# EAGLE design AdelinoX3 (EAGLE 9.3.2)
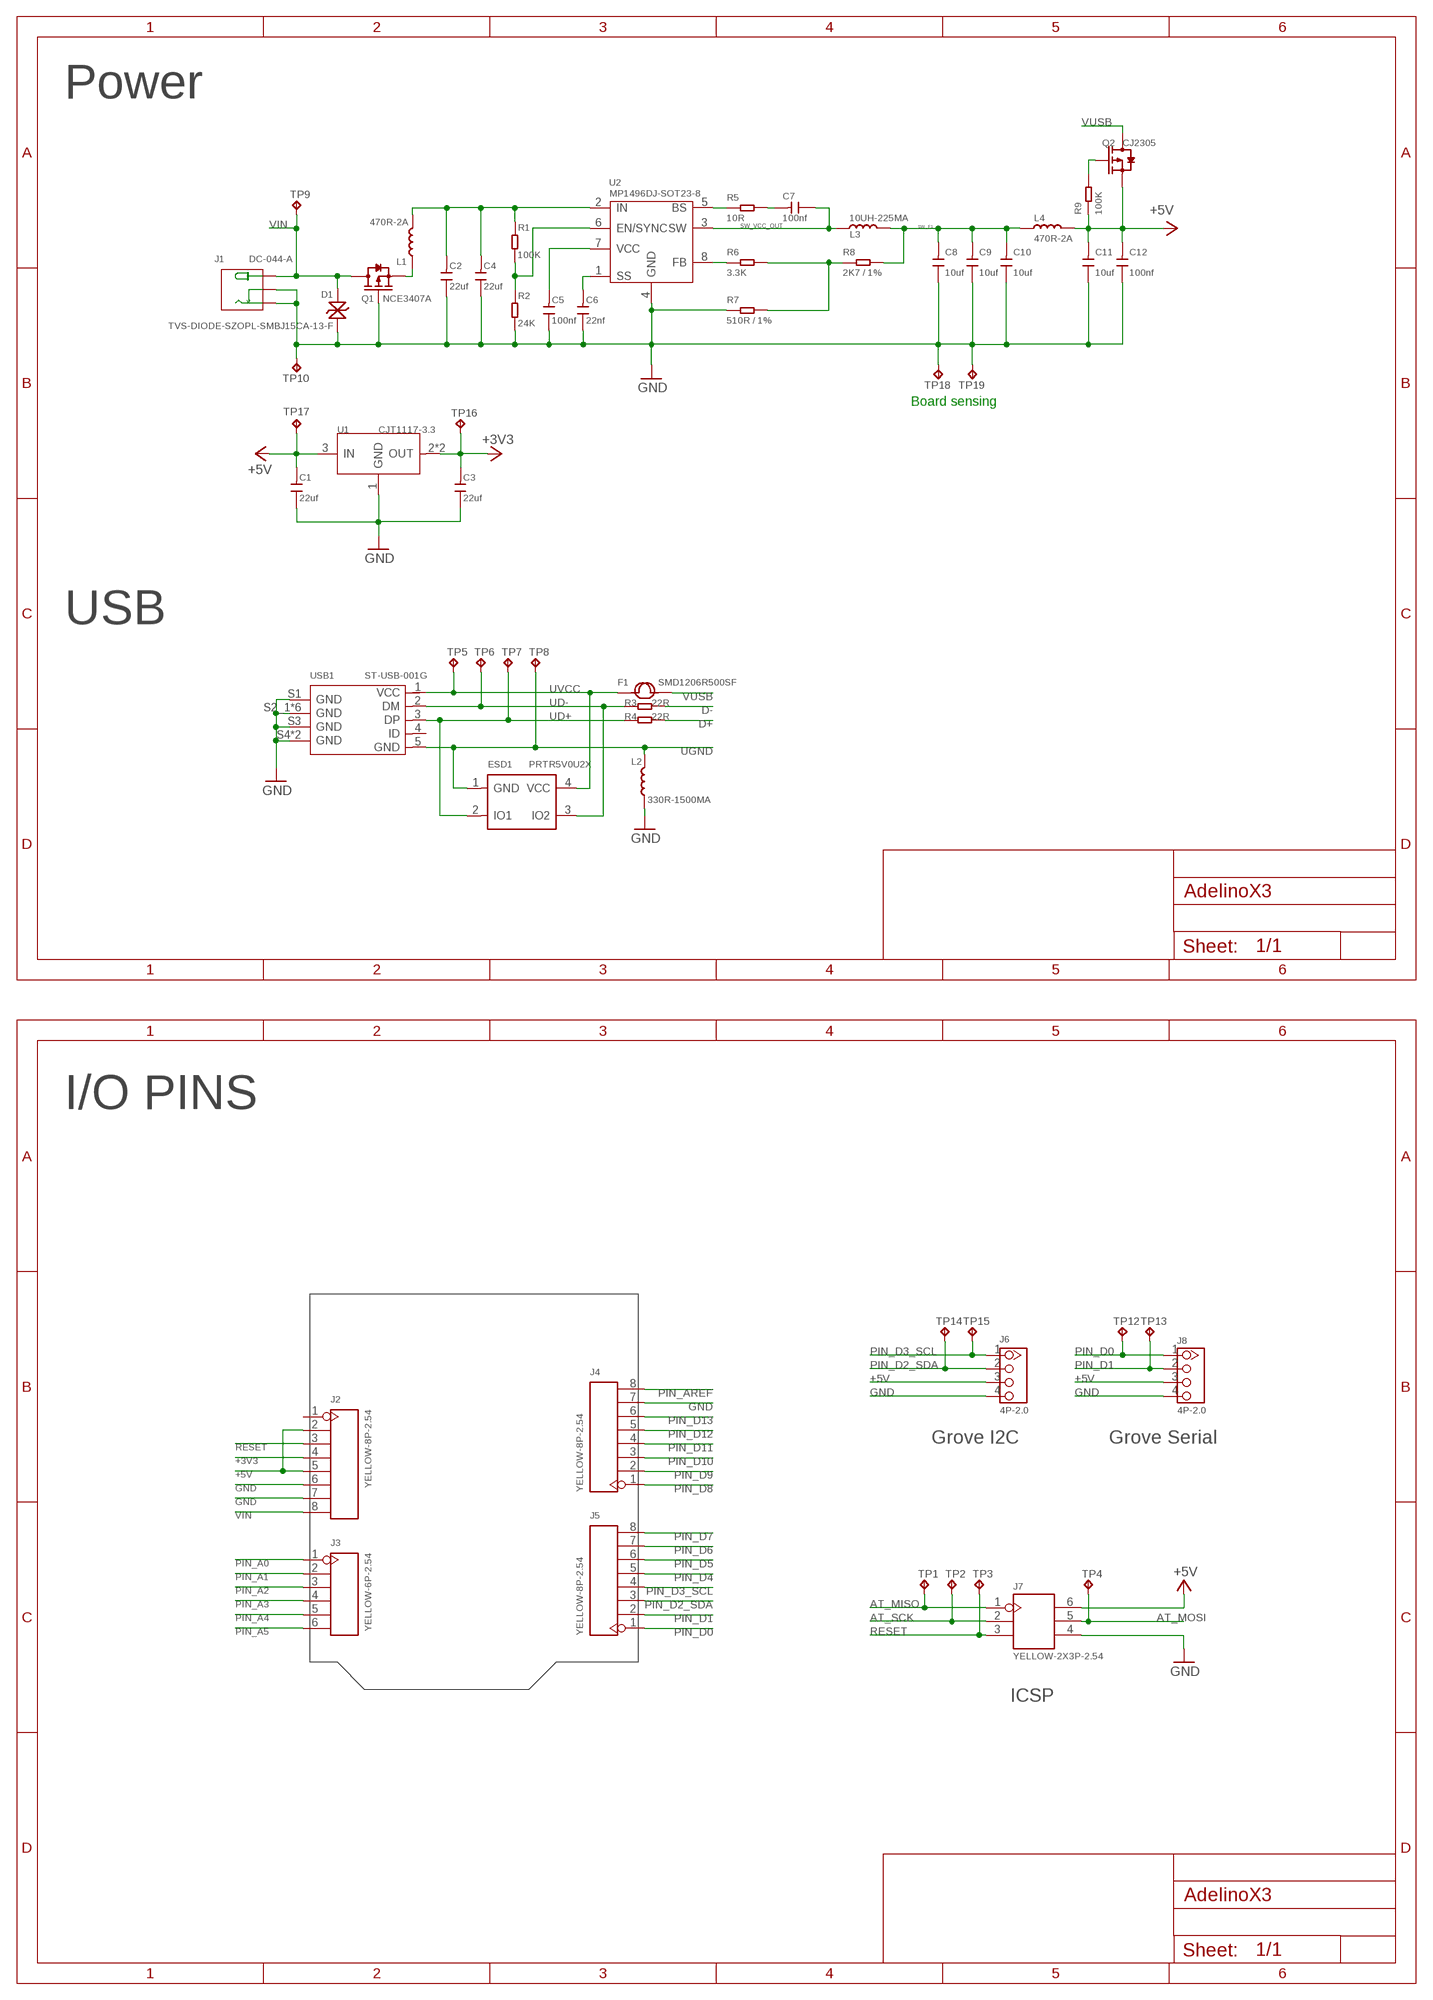
[diagram p0: schematic, sheet 1, part 1 of 2]
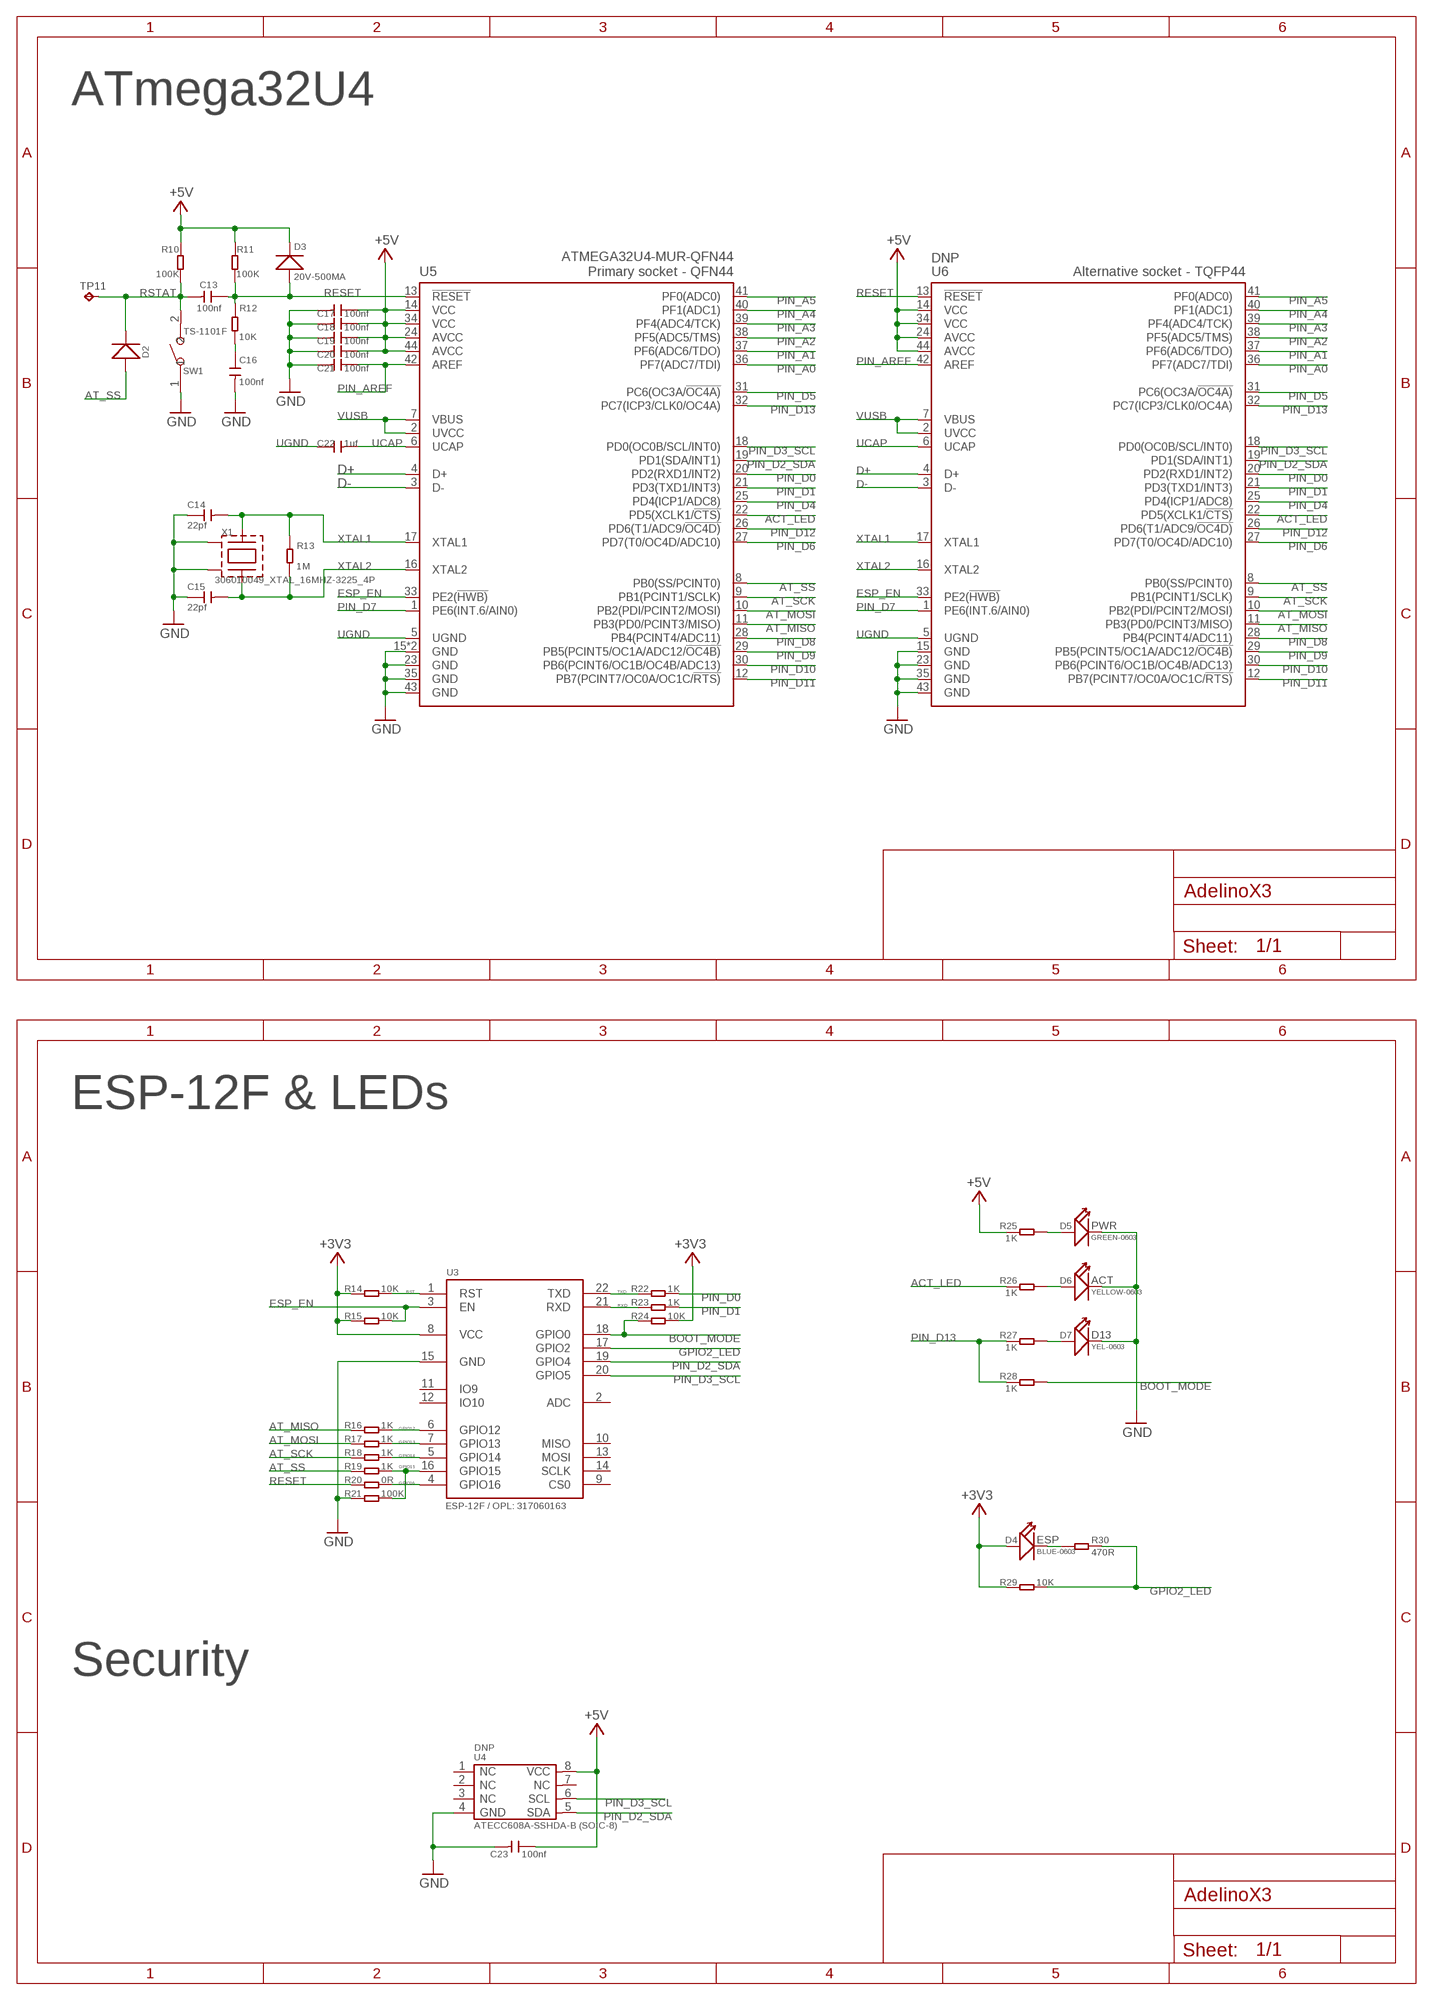
[diagram p1: schematic, sheet 1, part 2 of 2]

## Parts
C1  22uf  CERAMIC-22UF-16V-10%-X7R(1206)  [C1206]
C2  22uf  CERAMIC-22UF-16V-10%-X7R(1206)  [C1206]
C3  22uf  CERAMIC-22UF-16V-10%-X7R(1206)  [C1206]
C4  22uf  CERAMIC-22UF-16V-10%-X7R(1206)  [C1206]
C5  100nf  CERAMIC-100NF-50V-10%-X7R(0603)  [C0603]
C6  22nf  CERAMIC-22NF-50V-10%-X7R(0603)  [C0603]
C7  100nf  CERAMIC-100NF-50V-10%-X7R(0603)  [C0603]
C8  10uf  CERAMIC-10UF-25V-10%-X5R(0805)  [C0805]
C9  10uf  CERAMIC-10UF-25V-10%-X5R(0805)  [C0805]
C10  10uf  CERAMIC-10UF-25V-10%-X5R(0805)  [C0805]
C11  10uf  CERAMIC-10UF-25V-10%-X5R(0805)  [C0805]
C12  100nf  CERAMIC-100NF-50V-10%-X7R(0603)  [C0603]
C13  100nf  CERAMIC-100NF-50V-10%-X7R(0603)  [C0603]
C14  22pf  CERAMIC-22PF-50V-5%-NPO(0603)  [C0603]
C15  22pf  CERAMIC-22PF-50V-5%-NPO(0603)  [C0603]
C16  100nf  CERAMIC-100NF-50V-10%-X7R(0603)  [C0603]
C17  100nf  CERAMIC-100NF-50V-10%-X7R(0603)  [C0603]
C18  100nf  CERAMIC-100NF-50V-10%-X7R(0603)  [C0603]
C19  100nf  CERAMIC-100NF-50V-10%-X7R(0603)  [C0603]
C20  100nf  CERAMIC-100NF-50V-10%-X7R(0603)  [C0603]
C21  100nf  CERAMIC-100NF-50V-10%-X7R(0603)  [C0603]
C22  1uf  CERAMIC-1UF-25V-10%-X7R(0603)  [C0603]
C23  100nf  CERAMIC-100NF-50V-10%-X7R(0603)  [C0603]
D1  TVS-DIODE-SZOPL-SMBJ15CA-13-F  [DO-214AA]
D2  20V-500MA  SMD-DIODE-SCHOTTKY-20V-500MA(SOD-123)P  [SOD-123]
D3  20V-500MA  SMD-DIODE-SCHOTTKY-20V-500MA(SOD-123)P  [SOD-123]
D4  BLUE-0603  SMD-LED-CLEAR-BLUE(0603)  [LED-0603]
D5  GREEN-0603  SMD-LED-CLEAR-GREEN(0603)  [LED-0603]
D6  YELLOW-0603  SMD-LED-CLEAR-YELLOW(0603)  [LED-0603]
D7  YEL-0603  SMD-LED-CLEAR-YELLOW(0603)  [LED-0603]
ESD1  PRTR5V0U2X  SMD-DIODE-TVS-5.5V  [SOT-143B]
F1  SMD1206R500SF  SMD-PPTC-500MA(1206)  [F1206]
J1  DC-044-A  JACK-DC-044-A  [DCJ3P-11.6X9.6X7.0MM]
J2  YELLOW-8P-2.54  DIP-YELLOW-FEMALE-HEADER(8P-2.54)  [H8-2.54]
J3  YELLOW-6P-2.54  DIP-YELLOW-FEMALE-HEADER-VERT(6P-2.54)  [H6-2.54]
J4  YELLOW-8P-2.54  DIP-YELLOW-FEMALE-HEADER(8P-2.54)  [H8-2.54]
J5  YELLOW-8P-2.54  DIP-YELLOW-FEMALE-HEADER(8P-2.54)  [H8-2.54]
J6  4P-2.0  GROVE-CONNECTOR-DIP(4P-2.0)  [HW4-2.0]
J7  YELLOW-2X3P-2.54  DIP-YELLOW-MALE-HEADER-VERT(2X3P-2.54)  [H2X3-2.54]
J8  4P-2.0  GROVE-CONNECTOR-DIP(4P-2.0)  [HW4-2.0]
L1  470R-2A  SMD-FERRITE-BEAD-470R-2A(0805)'0805'  [L0805]
L2  330R-1500MA  SMD-FERRITE-BEAD-330R-1500MA(0805)'0805'  [L0805]
L3  10UH-225MA  SMD-INDUCTOR-10UH-20%-2.35A(2P-5X5X4MM)  [L5040S]
L4  470R-2A  SMD-FERRITE-BEAD-470R-2A(0805)'0805'  [L0805]
Q1  NCE3407A  SMD-MOSFET-P-CH-VDC=30V-ID=4.3A-NCE3407A(SOT-23)  [SOT-23]
Q2  CJ2305  SMD-MOSFET-P-CH-8V-4.1A-CJ2305(SOT-23)  [SOT-23]
R1  100K  SMD-RES-100K-5%-1/10W(0603)  [R0603]
R2  24K  SMD-RES-24K-1%-1/10W(0603)  [R0603]
R3  22R  SMD-RES-22R-5%-1/10W(0603)  [R0603]
R4  22R  SMD-RES-22R-5%-1/10W(0603)  [R0603]
R5  10R  SMD-RES-10R-1%-1/10W(0603)  [R0603]
R6  3.3K  SMD-RES-3.3K-5%-1/10W(0603)  [R0603]
R7  3K / 1%  SMD-RES-510R-1%-1/10W(0603)  [R0603]
R8  2K7 / 1%  SMD-RES-2.7K-1%-1/10W(0603)  [R0603]
R9  100K  SMD-RES-100K-5%-1/10W(0603)  [R0603]
R10  100K  SMD-RES-100K-5%-1/10W(0603)  [R0603]
R11  100K  SMD-RES-100K-5%-1/10W(0603)  [R0603]
R12  10K  SMD-RES-10K-5%-1/10W(0603)  [R0603]
R13  1M  SMD-RES-1M-5%-1/10W(0603)  [R0603]
R14  10K  SMD-RES-10K-5%-1/10W(0603)  [R0603]
R15  10K  SMD-RES-10K-5%-1/10W(0603)  [R0603]
R16  1K  SMD-RES-1K-5%-1/10W(0603)  [R0603]
R17  1K  SMD-RES-1K-5%-1/10W(0603)  [R0603]
R18  1K  SMD-RES-1K-5%-1/10W(0603)  [R0603]
R19  1K  SMD-RES-1K-5%-1/10W(0603)  [R0603]
R20  0R  SMD-RES-0R-5%-1/10W(0603)  [R0603]
R21  100K  SMD-RES-100K-5%-1/10W(0603)  [R0603]
R22  1K  SMD-RES-1K-5%-1/10W(0603)  [R0603]
R23  1K  SMD-RES-1K-5%-1/10W(0603)  [R0603]
R24  10K  SMD-RES-10K-5%-1/10W(0603)  [R0603]
R25  1K  SMD-RES-1K-5%-1/10W(0603)  [R0603]
R26  1K  SMD-RES-1K-5%-1/10W(0603)  [R0603]
R27  1K  SMD-RES-1K-5%-1/10W(0603)  [R0603]
R28  1K  SMD-RES-1K-5%-1/10W(0603)  [R0603]
R29  10K  SMD-RES-10K-5%-1/10W(0603)  [R0603]
R30  470R  SMD-RES-470R-5%-1/10W(0603)  [R0603]
SW1  TS-1101F  DIP-BUTTON(2P-6.0X3.0X4.3MM)-TS-1101F  [SW2-5.0-6.0X3.0X4.3MM]
TP1  TPTP16R  [TP16R]
TP2  TPTP16R  [TP16R]
TP3  TPTP16R  [TP16R]
TP4  TPTP16R  [TP16R]
TP5  TPTP16R  [TP16R]
TP6  TPTP16R  [TP16R]
TP7  TPTP16R  [TP16R]
TP8  TPTP16R  [TP16R]
TP9  TPTP16R  [TP16R]
TP10  TPTP16R  [TP16R]
TP11  TPTP16R  [TP16R]
TP12  TPTP16R  [TP16R]
TP13  TPTP16R  [TP16R]
TP14  TPTP16R  [TP16R]
TP15  TPTP16R  [TP16R]
TP16  TPTP16R  [TP16R]
TP17  TPTP16R  [TP16R]
TP18  TPTP16R  [TP16R]
TP19  TPTP16R  [TP16R]
U1  CJT1117-3.3  PMIC-CJT1117-3.3(SOT223)  [SOT-223]
U2  MP1496DJ-SOT23-8  PMIC-MP1496DJ(SOT23-8)  [SOT-23-8]
U3  ESP-12F / OPL: 317060163  ESP-12F  [ESP-12F]
U4  DNP  ATECC608(SOIC8)  [SOIC8-1.27-5X4MM]
U5  ATMEGA32U4-MUR-QFN44  MCU-ATMEGA32U4-MUR(VQFN44)  [QFN44G-0.5-7X7MM]
U6  DNP  MCU-ATMEGA32U4-AU(TQFP44)  [TQFP44-0.8-9.6X9.6MM]
USB1  ST-USB-001G  MICRO-USB-SMD-B-WITHOUT-POST-W/P(ST-USB-001G)  [MICRO-USB5+4P-SMD-0.65-B]
X1  306010049_XTAL_16MHZ-3225_4P  [X3225_4P]

## Nets
+3V3: C3.2 D4.+ J2.4 R14.1 R15.1 R24.2 R29.1 TP16.TP U1.2(OUT) U1.TER(OUT) U3.8(VCC)
+5V: C1.2 C11.2 C12.2 C17.1 C18.1 C19.1 C20.1 C23.1 D3.- J2.2 J2.5 J6.3 J7.6 J8.3 L4.2 Q2.2(S) R9.1 R10.1 R11.2 R25.1 TP17.TP U1.3(IN) U4.8(VCC) U5.14(VCC) U5.24(AVCC) U5.34(VCC) U5.44(AVCC) U6.14(VCC) U6.24(AVCC) U6.34(VCC) U6.44(AVCC)
_ACT: D6.+ R26.2
_D13: D7.+ R27.2
_ESP: D4.- R30.1
_PWR: D5.+ R25.2
ACT_LED: R26.1 U5.22(PD5(XCLK1/!CTS)) U6.22(PD5(XCLK1/!CTS))
AT_MISO: J7.1 R16.1 TP1.TP U5.11(PB3(PD0/PCINT3/MISO)) U6.11(PB3(PD0/PCINT3/MISO))
AT_MOSI: J7.5 R17.1 TP4.TP U5.10(PB2(PDI/PCINT2/MOSI)) U6.10(PB2(PDI/PCINT2/MOSI))
AT_SCK: J7.2 R18.1 TP2.TP U5.9(PB1(PCINT1/SCLK)) U6.9(PB1(PCINT1/SCLK))
AT_SS: D2.+ R19.1 U5.8(PB0(SS/PCINT0)) U6.8(PB0(SS/PCINT0))
BOOT_MODE: R24.1 R28.2 U3.18(GPIO0)
D+: R4.2 U5.4(D+) U6.4(D+)
D-: R3.2 U5.3(D-) U6.3(D-)
ESP_EN: R15.2 U3.3(EN) U5.33(PE2(!HWB)) U6.33(PE2(!HWB))
GND: C1.1 C2.1 C3.1 C4.1 C5.1 C6.1 C8.1 C9.1 C10.1 C11.1 C12.1 C14.1 C15.1 C16.2 C17.2 C18.2 C19.2 C20.2 C21.2 C23.2 D1.+ D5.- D6.- D7.- J1.CDN1(CDN) J1.CDN2(CDN) J1.CDN3(CDN) J1.CDN4(CDN) J1.GND1(-) J1.GND2(-) J1.GND3(-) J1.GND4(-) J2.6 J2.7 J4.7 J6.4 J7.4 J8.4 L2.1 Q1.1(G) R2.1 R7.1 R21.1 SW1.1 TP10.TP TP18.TP TP19.TP U1.1(GND) U2.4(GND) U3.15(GND) U4.4(GND) U5.15(GND) U5.23(GND) U5.35(GND) U5.43(GND) U5.TAB(GND) U6.15(GND) U6.23(GND) U6.35(GND) U6.43(GND) USB1.S1(GND) USB1.S2_1(GND) USB1.S2_2(GND) USB1.S2_3(GND) USB1.S3(GND) USB1.S4(GND) USB1.S5_1(GND) USB1.S5_2(GND) USB1.S5_3(GND) USB1.S6(GND) X1.P$2(GND1) X1.P$4(GND2)
GPIO2_LED: R29.2 R30.2 U3.17(GPIO2)
GPIO12: R16.2 U3.6(GPIO12)
GPIO13: R17.2 U3.7(GPIO13)
GPIO14: R18.2 U3.5(GPIO14)
GPIO15: R19.2 R21.2 U3.16(GPIO15)
GPIO16: R20.2 U3.4(GPIO16)
N$3: Q2.1(G) R9.2
N$7: R1.2 R2.2 U2.6(EN/SYNC)
N$8: L1.1 Q1.2(S)
N$13: C16.1 R12.2
N$15: C7.2 R5.2
N$23: R6.2 R7.2 R8.1
PIN_A0: J3.1 U5.36(PF7(ADC7/TDI)) U6.36(PF7(ADC7/TDI))
PIN_A1: J3.2 U5.37(PF6(ADC6/TDO)) U6.37(PF6(ADC6/TDO))
PIN_A2: J3.3 U5.38(PF5(ADC5/TMS)) U6.38(PF5(ADC5/TMS))
PIN_A3: J3.4 U5.39(PF4(ADC4/TCK)) U6.39(PF4(ADC4/TCK))
PIN_A4: J3.5 U5.40(PF1(ADC1)) U6.40(PF1(ADC1))
PIN_A5: J3.6 U5.41(PF0(ADC0)) U6.41(PF0(ADC0))
PIN_AREF: C21.1 J4.8 U5.42(AREF) U6.42(AREF)
PIN_D0: J5.1 J8.1 R22.2 TP12.TP U5.20(PD2(RXD1/INT2)) U6.20(PD2(RXD1/INT2))
PIN_D1: J5.2 J8.2 R23.2 TP13.TP U5.21(PD3(TXD1/INT3)) U6.21(PD3(TXD1/INT3))
PIN_D2_SDA: J5.3 J6.2 TP14.TP U3.19(GPIO4) U4.5(SDA) U5.19(PD1(SDA/INT1)) U6.19(PD1(SDA/INT1))
PIN_D3_SCL: J5.4 J6.1 TP15.TP U3.20(GPIO5) U4.6(SCL) U5.18(PD0(OC0B/SCL/INT0)) U6.18(PD0(OC0B/SCL/INT0))
PIN_D4: J5.5 U5.25(PD4(ICP1/ADC8)) U6.25(PD4(ICP1/ADC8))
PIN_D5: J5.6 U5.31(PC6(OC3A/!OC4A)) U6.31(PC6(OC3A/!OC4A))
PIN_D6: J5.7 U5.27(PD7(T0/OC4D/ADC10)) U6.27(PD7(T0/OC4D/ADC10))
PIN_D7: J5.8 U5.1(PE6(INT.6/AIN0)) U6.1(PE6(INT.6/AIN0))
PIN_D8: J4.1 U5.28(PB4(PCINT4/ADC11)) U6.28(PB4(PCINT4/ADC11))
PIN_D9: J4.2 U5.29(PB5(PCINT5/OC1A/ADC12/!OC4B)) U6.29(PB5(PCINT5/OC1A/ADC12/!OC4B))
PIN_D10: J4.3 U5.30(PB6(PCINT6/OC1B/OC4B/ADC13)) U6.30(PB6(PCINT6/OC1B/OC4B/ADC13))
PIN_D11: J4.4 U5.12(PB7(PCINT7/OC0A/OC1C/!RTS)) U6.12(PB7(PCINT7/OC0A/OC1C/!RTS))
PIN_D12: J4.5 U5.26(PD6(T1/ADC9/!OC4D)) U6.26(PD6(T1/ADC9/!OC4D))
PIN_D13: J4.6 R27.1 R28.1 U5.32(PC7(ICP3/CLK0/OC4A)) U6.32(PC7(ICP3/CLK0/OC4A))
RESET: C13.1 D3.+ J2.3 J7.3 R11.1 R12.1 R20.1 TP3.TP U5.13(!RESET) U6.13(!RESET)
RST: R14.2 U3.1(RST)
RSTAT: C13.2 D2.- R10.2 SW1.2 TP11.TP
RXD: R23.1 U3.21(RXD)
SW_BS: R5.1 U2.5(BS)
SW_F1: C8.2 C9.2 C10.2 L3.2 L4.1 R8.2
SW_FB: R6.1 U2.8(FB)
SW_SS: C6.2 U2.1(SS)
SW_VCAP: C5.2 U2.7(VCC)
SW_VCC_IN: C2.2 C4.2 L1.2 R1.1 U2.2(IN)
SW_VCC_OUT: C7.1 L3.1 U2.3(SW)
TXD: R22.1 U3.22(TXD)
UCAP: C22.2 U5.6(UCAP) U6.6(UCAP)
UD+ [usb]: ESD1.2(IO1) R4.1 TP7.TP USB1.3(DP)
UD- [usb]: ESD1.3(IO2) R3.1 TP6.TP USB1.2(DM)
UGND: C22.1 ESD1.1(GND) L2.2 TP8.TP U5.5(UGND) U6.5(UGND) USB1.5(GND)
UVCC: ESD1.4(VCC) F1.1 TP5.TP USB1.1(VCC)
VIN: D1.- J1.VCC1(+) J1.VCC2(+) J1.VCC3(+) J1.VCC4(+) J2.8 Q1.3(D) TP9.TP
VUSB: F1.2 Q2.3(D) U5.2(UVCC) U5.7(VBUS) U6.2(UVCC) U6.7(VBUS)
XTAL1: C14.2 R13.2 U5.17(XTAL1) U6.17(XTAL1) X1.P$1
XTAL2: C15.2 R13.1 U5.16(XTAL2) U6.16(XTAL2) X1.P$3
Unconnected: J2.1 U3.2(ADC) U3.9(CS0) U3.10(MISO) U3.11(IO9) U3.12(IO10) U3.13(MOSI) U3.14(SCLK) U4.1(NC1) U4.2(NC2) U4.3(NC3) U4.7(NC4) USB1.4(ID)

## Notes on the sheet
- Power | ATmega32U4
- Board sensing
- USB
- I/O PINS | ESP-12F & LEDs
- Grove I2C | Grove Serial
- Security
- ICSP

## Library data of the parts
C1 C2 C4 = Seeed-Capacitor:CERAMIC-22UF-16V-10%-X7R(1206): 302010182
C3 = OPL_Capacitor:CERAMIC-22UF-16V-10%-X7R(1206): 302010182
C5 C7 C12 C13 C16-C21 = OPL_Capacitor:CERAMIC-100NF-50V-10%-X7R(0603): 302010138; MPN: CC0603KRX7R9BB104
C6 = Seeed-Capacitor:CERAMIC-22NF-50V-10%-X7R(0603): 302010095; MPN: CC0603KRX7R9BB223
C8-C11 = Seeed-Capacitor:CERAMIC-10UF-25V-10%-X5R(0805): 302010178; MPN: CC0805KKX5R8BB106
C14 C15 = Seeed-Capacitor:CERAMIC-22PF-50V-5%-NPO(0603): 302010143; MPN: CC0603JRNPO9BN220
C22 = Seeed-Capacitor:CERAMIC-1UF-25V-10%-X7R(0603): 302010139; MPN: CC0603KRX7R8BB105
C23 = Seeed-Capacitor:CERAMIC-100NF-50V-10%-X7R(0603): 302010138; MPN: CC0603KRX7R9BB104
D1 = Adelino-Misc:TVS-DIODE-SZOPL-SMBJ15CA-13-F: SMD Diode TVS 24VWM/38.9VC-600W;DO-214AA(SMB); MPN: SMBJ15CA-13-F; SKU: SHENZHEN-OPL;TVS DIODE 15VWM 24.4VC SMB
D2 D3 = Seeed-Diode:SMD-DIODE-SCHOTTKY-20V-500MA(SOD-123)P: 304020028; MPN: MBR0520LT1G
D4 = Seeed-LED:SMD-LED-CLEAR-BLUE(0603): 304090045; LABEL: ESP; MPN: 19-217-BHC-ZL1M2RY-3T
D5 = Seeed-LED:SMD-LED-CLEAR-GREEN(0603): 304090043; LABEL: PWR; MPN: 19-217-G7C-AN1P2-3T
D6 = Seeed-LED:SMD-LED-CLEAR-YELLOW(0603): 304090044; LABEL: ACT; MPN: 19-217-Y5C-AM1N1VY-3T
D7 = Seeed-LED:SMD-LED-CLEAR-YELLOW(0603): 304090044; LABEL: D13; MPN: 19-217-Y5C-AM1N1VY-3T; VALUE: YELLOW-0603
ESD1 = Seeed-OPL-2017-01-Diode-james:SMD-DIODE-TVS-5.5V: SMD Diode TVS;5.5V; MPN: NXP;PRTR5V0U2X,215; SKU: 304050022
F1 = Seeed-Fuse:SMD-PPTC-500MA(1206): 307010002; MPN: SMD1206R500SF
J1 = Seeed-Connector:JACK-DC-044-A: 320120002; MPN: JACK-DC-044-A
J2 J4 J5 = Seeed-Connector:DIP-YELLOW-FEMALE-HEADER(8P-2.54): 320030065; MPN: F185-1108A1BSYC1
J3 = Seeed-Connector:DIP-YELLOW-FEMALE-HEADER-VERT(6P-2.54): 320030019; MPN: F185-1106A1BSYA3
J6 J8 = Seeed-Connector:GROVE-CONNECTOR-DIP(4P-2.0): 320110033
J7 = Seeed-Connector:DIP-YELLOW-MALE-HEADER-VERT(2X3P-2.54): 320020027; MPN: P125-1203A0BS116A2
L1 L4 = OPL_Ferrite_and_Magnetic_Bead:SMD-FERRITE-BEAD-470R-2A(0805): 303030008; MPN: WLB2012-471T20
L2 = Seeed-Inductor:SMD-FERRITE-BEAD-330R-1500MA(0805): 303030006; MPN: BLM21PG331SN1D
L3 = Seeed-Inductor:SMD-INDUCTOR-10UH-20%-2.35A(2P-5X5X4MM): 303010147
Q1 = Seeed-Transistor:SMD-MOSFET-P-CH-VDC=30V-ID=4.3A-NCE3407A(SOT-23): 305030010; MPN: NCE3407A
Q2 = Seeed-Transistor:SMD-MOSFET-P-CH-8V-4.1A-CJ2305(SOT-23): 305030014; MPN: CJ2305
R1 R9-R11 R21 = Seeed-Resistor:SMD-RES-100K-5%-1/10W(0603): 301010089; MPN: RC0603JR-07100KL; VALUE: 100K 1/10W
R2 = Seeed-Resistor:SMD-RES-24K-1%-1/10W(0603): 301010232
R3 R4 = Seeed-Resistor:SMD-RES-22R-5%-1/10W(0603): 301010289; MPN: RC0603JR-0722RL
R5 = Seeed-Resistor:SMD-RES-10R-1%-1/10W(0603): 301010185; MPN: RC0603FR-0710RL
R6 = Seeed-Resistor:SMD-RES-3.3K-5%-1/10W(0603): 301010112
R7 = Seeed-Resistor:SMD-RES-510R-1%-1/10W(0603): 301010215; R: 510R / 1%
R8 = Seeed-Resistor:SMD-RES-2.7K-1%-1/10W(0603): 301010193; R: 2K7 / 1%
R12 R14 R15 R24 R29 = Seeed-Resistor:SMD-RES-10K-5%-1/10W(0603): 301010293; MPN: RC0603JR-0710KL; VALUE: 10K 1/10W
R13 = Seeed-Resistor:SMD-RES-1M-5%-1/10W(0603): 301010100; MPN: RC0603JR-071ML; VALUE: 1M 1/10W
R16-R19 R22 R23 R25-R28 = Seeed-Resistor:SMD-RES-1K-5%-1/10W(0603): 301010291; MPN: RC0603JR-071KL; VALUE: 1K 1/10W
R20 = Seeed-Resistor:SMD-RES-0R-5%-1/10W(0603): 301010292; MPN: RC0603JR-070RL
R30 = Seeed-Resistor:SMD-RES-470R-5%-1/10W(0603): 301010088; MPN: RC0603JR-07470RL
SW1 = Seeed-Switch:DIP-BUTTON(2P-6.0X3.0X4.3MM): 311020025; MPN: TS-1101F
TP1-TP19 = testpad:TP: Test pad
U1 = Seeed-IC:PMIC-CJT1117-3.3(SOT223): 310030097; MPN: CJT1117-3.3; VALUE: CJT1117-3.3-SOT223
U2 = Seeed-IC:PMIC-MP1496DJ(SOT23-8): 310030121; MPN: MP1496DJ
U3 = Adelino-Misc:ESP-12F: 317060163
U4 = Adelino-Misc:ATECC608(SOIC8): ATECC608; DESC: ATECC608A-SSHDA-B (SOIC-8); MOUSER_REF: https://www.mouser.com/ProductDetail/556-ATECC608ASSHDAB; MPN: ATECC608A-SSHDA-B; VALUE: ATECC608-SOIC8
U5 = Seeed-IC:MCU-ATMEGA32U4-MUR(VQFN44): 310010016; DESC: Primary socket - QFN44; MPN: ATMEGA32U4-MUR
U6 = Seeed-IC:MCU-ATMEGA32U4-AU(TQFP44): 310010010; DESC: Alternative socket - TQFP44; MPN: ATMEGA32U4; VALUE: ATMEGA32U4-TQFP44
USB1 = Seeed-Connector:MICRO-USB-SMD-B-WITHOUT-POST-W/P(ST-USB-001G): 320010000; MPN: ST-USB-001G
X1 = Seeed-OPL-2017-01-Crystal-Akita:306010049_XTAL_16MHZ-3225_4P: SMD Crystal 16MHz-9pF-10ppm-40R;4P-L3.2*W2.5mm, SKU: 306010049

## Net classes
0 default: width 0.203 mm, drill 0.203 mm, clearance 0.254 mm
1 usb: width 0.203 mm, clearance 0.203 mm

## Board
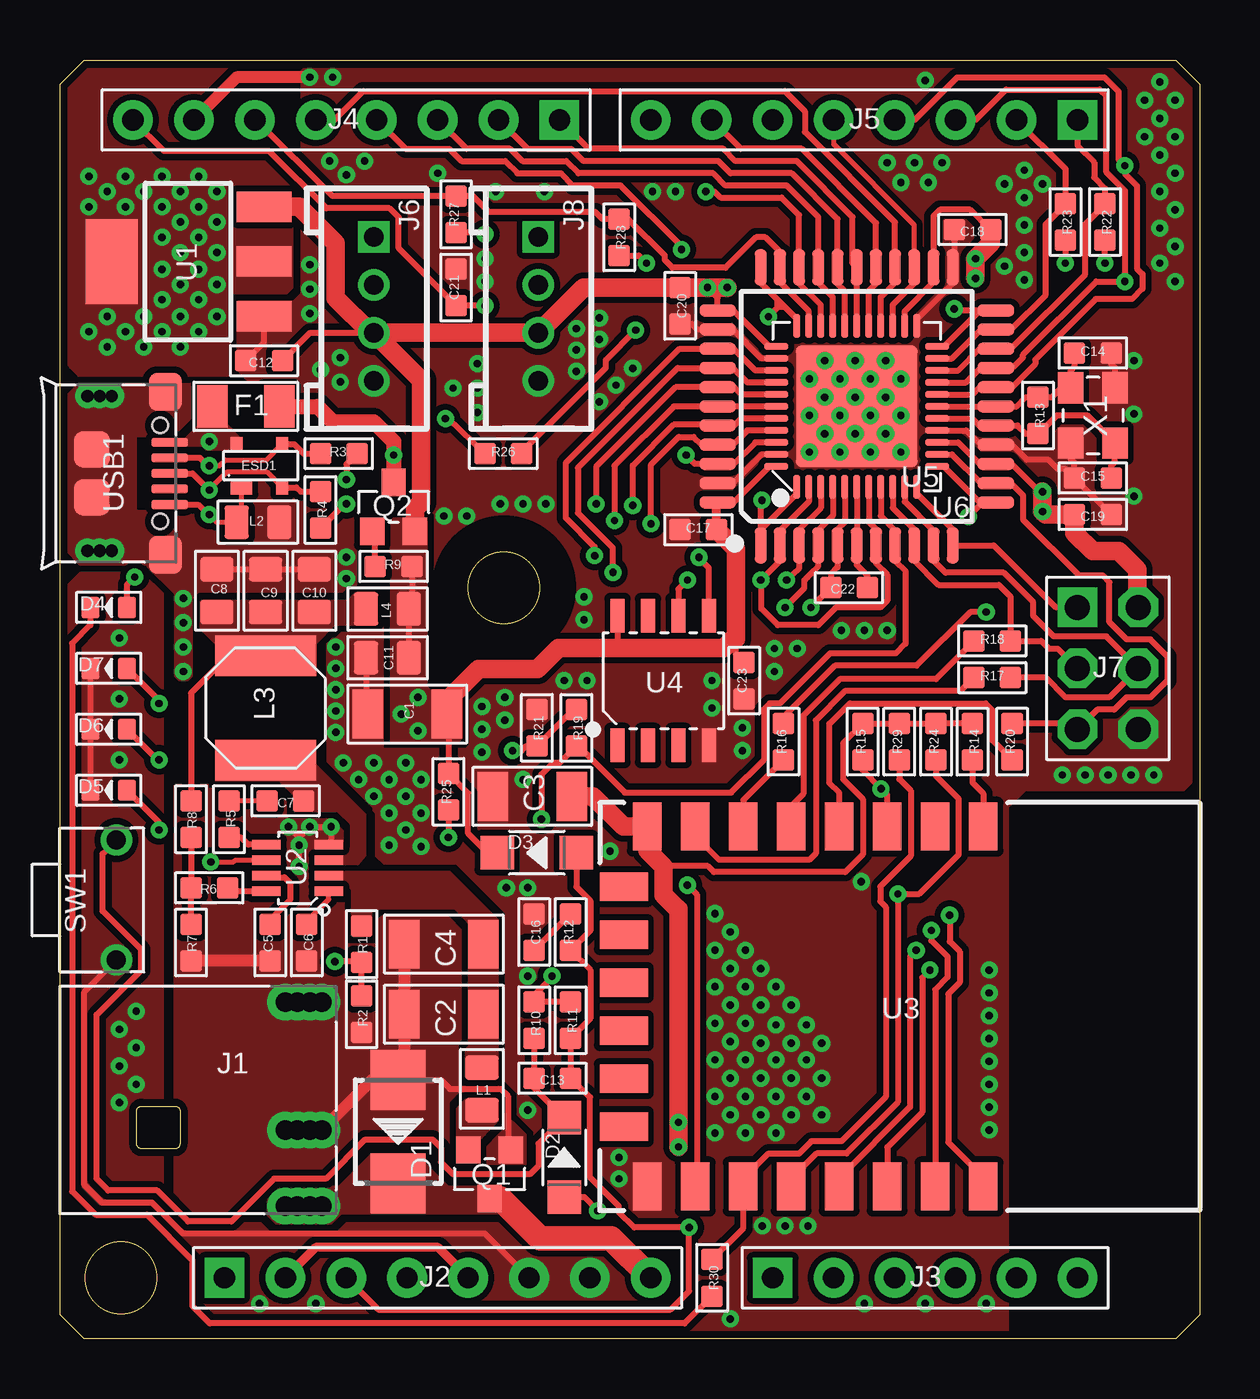
[diagram p2: board, top side]
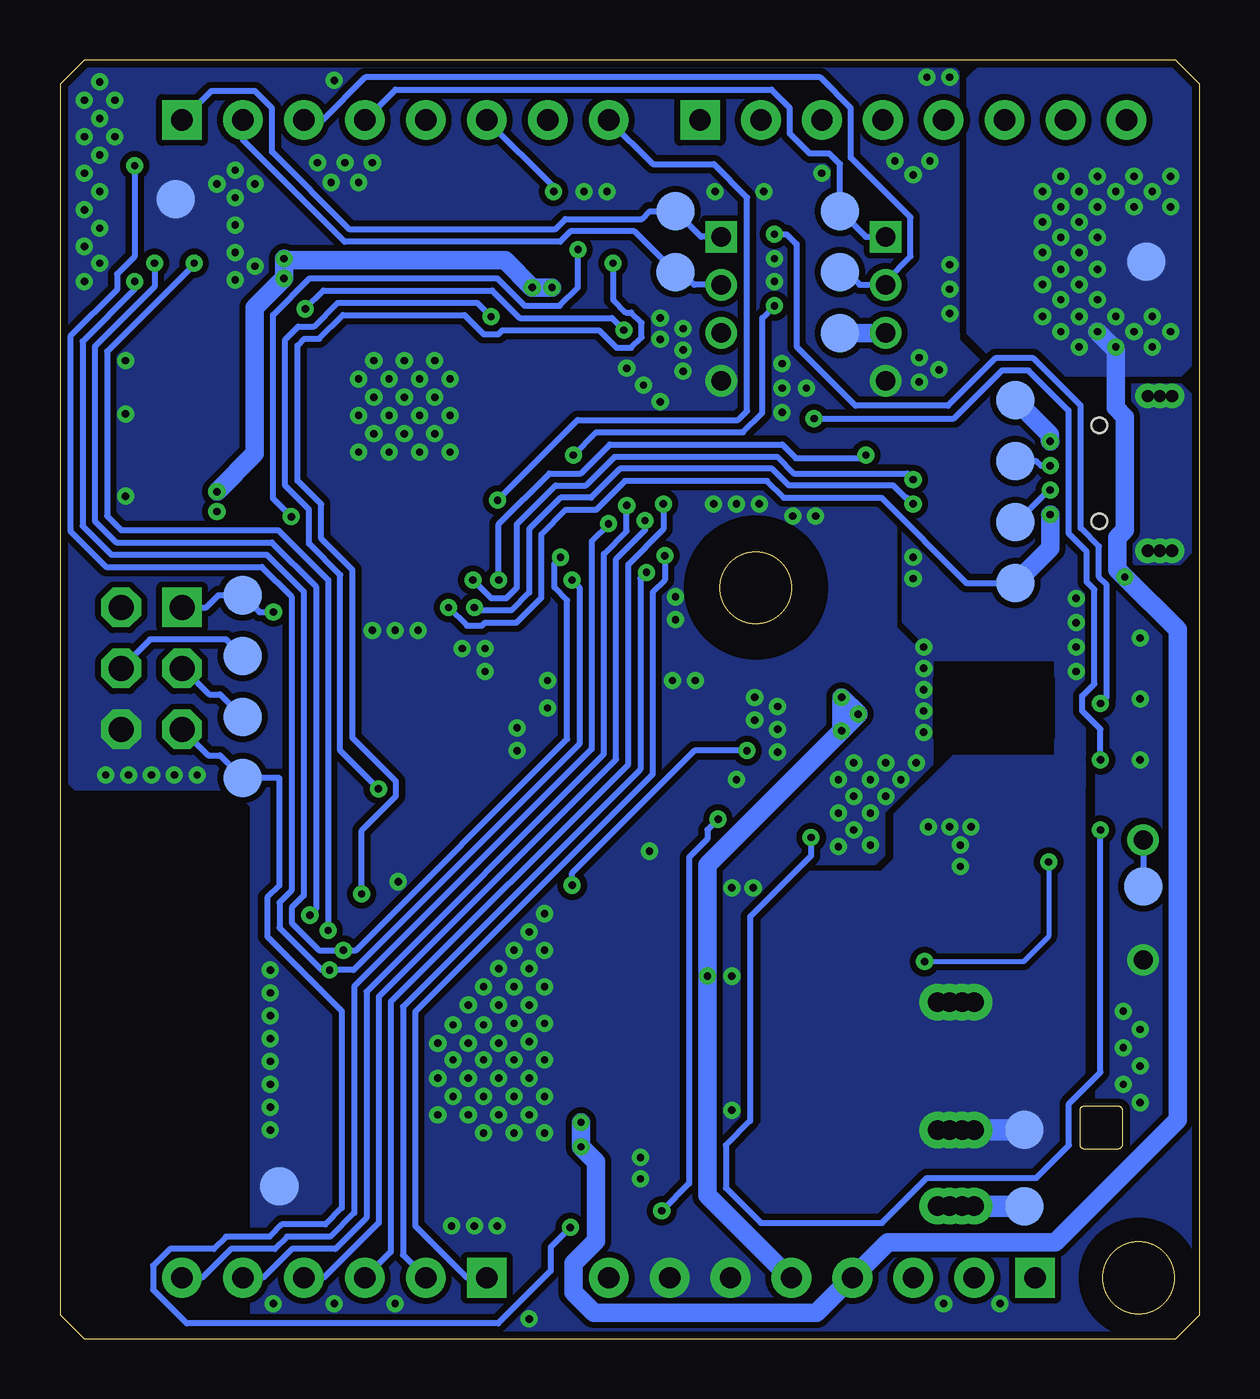
[diagram p3: board, bottom side, seen from below]

Size 47.5 x 53.3 mm. Coordinates in mm from the lower left corner, seen from the top.
Outline: 0,1 0,52.3 1,53.3 46.5,53.3 47.5,52.3 47.5,1 46.5,0 1,0 0,1
Outline: circle at 2.54,2.54 radius 1.5
Outline: circle at 18.5,31.3 radius 1.5
Copper layers (1*16): Top 0.035mm / dielectric 1.5mm / Bottom 0.035mm
Design rules "Adelino_SeeedStudio_defaults *": minimum track width 6mil, minimum drill 12mil, track to track 6mil, track to pad 6mil, pad to pad 6mil, via to via 8mil, smd to smd 6mil, copper to edge 12mil, drill to drill 12mil, minimum pad ring 10mil, minimum via ring 8mil, stop-mask expansion 2mil, vias tented up to drill 100mil, thermal gap 10mil
tKeepout: area 0.5,0.5 to 4.5,4.5; area 16.2,29.1 to 20.8,33.5
bKeepout: area 16.2,29.1 to 20.8,33.5; area 0.5,0.5 to 4.5,4.5
tRestrict: area 0.5,0.5 to 4.5,4.5; area 16.2,29.1 to 20.8,33.5; area 6,25.3 to 11.1,27.3
bRestrict: area 0.5,0.5 to 4.5,4.5; area 16.2,29.1 to 20.8,33.5; area 6,25 to 11.1,27.6

### Footprints (pad centres in the part's own frame; a part is rotated, then mirrored left to right if it is on the bottom)
C1206 = smd 1.27 x 2.032: 1 -1.651,0; 2 1.651,0
C0603 = smd 0.889 x 0.889: 1 0,0.762; 2 0,-0.762
C0805 = smd 1.397 x 1.016: 1 0,0.889; 2 0,-0.889
DO-214AA = smd 2.5 x 2.3: + -2.15,0; - 2.15,0
SOD-123 = smd 1.397 x 1.397: + -1.651,0; - 1.651,0
LED-0603 = smd 0.762 x 0.889: + -0.762,0; - 0.762,0
SOT-143B = smd 0.9 x 0.6: 1 -0.75,-0.9 | smd 0.5 x 0.6: 2 0.95,-0.9; 3 0.95,0.9; 4 -0.95,0.9
F1206 = smd 1.27 x 1.778: 1 -1.397,0; 2 1.397,0
DCJ3P-11.6X9.6X7.0MM = drill 0.813 pad 1.524: CDN1 1.206,10.922; CDN2 1.206,10.414; CDN3 1.206,9.906; CDN4 1.206,9.398; GND1 -4.128,10.922; GND2 -4.128,10.414; GND3 -4.128,9.906; GND4 -4.128,9.398; VCC1 4.381,10.922; VCC2 4.381,10.414; VCC3 4.381,9.906; VCC4 4.381,9.398
H8-2.54 = drill 0.889 pad 1.651 square: 1 0,8.89 | drill 0.889 pad 1.651: 2 0,6.35; 3 0,3.81; 4 0,1.27; 5 0,-1.27; 6 0,-3.81; 7 0,-6.35; 8 0,-8.89
H6-2.54 = drill 0.889 pad 1.651 square: 1 0,6.35 | drill 0.889 pad 1.651: 2 0,3.81; 3 0,1.27; 4 0,-1.27; 5 0,-3.81; 6 0,-6.35
HW4-2.0 = drill 0.8 pad 1.27 square: 1 -3,0 | drill 0.8 pad 1.27: 2 -1,0; 3 1,0; 4 3,0
H2X3-2.54 = drill 1.041 pad 1.651 square: 1 -1.27,2.54 | drill 1.041 pad 1.651 octagon: 2 -1.27,0; 3 -1.27,-2.54; 4 1.27,-2.54; 5 1.27,0; 6 1.27,2.54
L0805 = smd 1.016 x 1.397: 1 -0.889,0; 2 0.889,0
L5040S = smd 4.2 x 1.7: 1 0,2.175; 2 0,-2.175
SOT-23 = smd 1.016 x 1.143: 1 -0.889,-1.016; 2 0.889,-1.016; 3 0,1.016
R0603 = smd 0.889 x 0.889: 1 0,0.762; 2 0,-0.762
SW2-5.0-6.0X3.0X4.3MM = drill 0.8 pad 1.27: 1 -2.5,0; 2 2.5,0
TP16R = smd 1.6 x 1.6: TP 0,0
SOT-223 = smd 1.27 x 2.286: 1 -2.286,-3.175; 2 0,-3.175; 3 2.286,-3.175 | smd 3.556 x 2.159: TER 0,3.175
SOT-23-8 = smd 0.4 x 1.2: 1 -0.975,-1.3; 2 -0.325,-1.3; 3 0.325,-1.3; 4 0.975,-1.3; 5 0.975,1.3; 6 0.325,1.3; 7 -0.325,1.3; 8 -0.975,1.3
ESP-12F = smd 2 x 1.2: 1 -7.5,3.48; 2 -7.5,1.48; 3 -7.5,-0.52; 4 -7.5,-2.52; 5 -7.5,-4.52; 6 -7.5,-6.52; 7 -7.5,-8.52; 8 -7.5,-10.52; 15 7.5,-10.52; 16 7.5,-8.52; 17 7.5,-6.52; 18 7.5,-4.52; 19 7.5,-2.52; 20 7.5,-0.52; 21 7.5,1.48; 22 7.5,3.48 | smd 1.2 x 2: 9 -5,-11.5; 10 -3,-11.5; 11 -1,-11.5; 12 1,-11.5; 13 3,-11.5; 14 5,-11.5
SOIC8-1.27-5X4MM = smd 0.6 x 1.4: 1 -1.905,-2.7; 2 -0.635,-2.7; 3 0.635,-2.7; 4 1.905,-2.7; 5 1.905,2.7; 6 0.635,2.7; 7 -0.635,2.7; 8 -1.905,2.7
QFN44G-0.5-7X7MM = smd 1 x 0.3: 1 -3.35,2.5; 2 -3.35,2; 3 -3.35,1.5; 4 -3.35,1; 5 -3.35,0.5; 6 -3.35,0; 7 -3.35,-0.5; 8 -3.35,-1; 9 -3.35,-1.5; 10 -3.35,-2; 11 -3.35,-2.5; 23 3.35,-2.5; 24 3.35,-2; 25 3.35,-1.5; 26 3.35,-1; 27 3.35,-0.5; 28 3.35,0; 29 3.35,0.5; 30 3.35,1; 31 3.35,1.5; 32 3.35,2; 33 3.35,2.5 | smd 0.3 x 1: 12 -2.5,-3.35; 13 -2,-3.35; 14 -1.5,-3.35; 15 -1,-3.35; 16 -0.5,-3.35; 17 0,-3.35; 18 0.5,-3.35; 19 1,-3.35; 20 1.5,-3.35; 21 2,-3.35; 22 2.5,-3.35; 34 2.5,3.35; 35 2,3.35; 36 1.5,3.35; 37 1,3.35; 38 0.5,3.35; 39 0,3.35; 40 -0.5,3.35; 41 -1,3.35; 42 -1.5,3.35; 43 -2,3.35; 44 -2.5,3.35 | smd 5.08 x 5.08: TAB 0,0
TQFP44-0.8-9.6X9.6MM = smd 1.5 x 0.5: 1 -5.8,4; 2 -5.8,3.2; 3 -5.8,2.4; 4 -5.8,1.6; 5 -5.8,0.8; 6 -5.8,0; 7 -5.8,-0.8; 8 -5.8,-1.6; 9 -5.8,-2.4; 10 -5.8,-3.2; 11 -5.8,-4; 23 5.8,-4; 24 5.8,-3.2; 25 5.8,-2.4; 26 5.8,-1.6; 27 5.8,-0.8; 28 5.8,0; 29 5.8,0.8; 30 5.8,1.6; 31 5.8,2.4; 32 5.8,3.2; 33 5.8,4 | smd 0.5 x 1.5: 12 -4,-5.8; 13 -3.2,-5.8; 14 -2.4,-5.8; 15 -1.6,-5.8; 16 -0.8,-5.8; 17 0,-5.8; 18 0.8,-5.8; 19 1.6,-5.8; 20 2.4,-5.8; 21 3.2,-5.8; 22 4,-5.8; 34 4,5.8; 35 3.2,5.8; 36 2.4,5.8; 37 1.6,5.8; 38 0.8,5.8; 39 0,5.8; 40 -0.8,5.8; 41 -1.6,5.8; 42 -2.4,5.8; 43 -3.2,5.8; 44 -4,5.8
MICRO-USB5+4P-SMD-0.65-B = smd 0.381 x 1.524: 1 -1.3,-0.25; 2 -0.65,-0.25; 3 0,-0.25; 4 0.65,-0.25; 5 1.3,-0.25 | smd 1.6 x 1.397: S1 -3.4,-0.427; S6 3.4,-0.427 | drill 0.508 pad 1.016: S2_1 -3.226,-3.683; S2_2 -3.226,-3.175; S2_3 -3.226,-2.667; S5_1 3.226,-3.683; S5_2 3.226,-3.175; S5_3 3.226,-2.667 | smd 1.5 x 1.5: S3 -1,-3.5; S4 1,-3.5 | hole 0.635: -2,-0.65; 2,-0.65
X3225_4P = smd 1.3 x 1.05: P$1 -1.15,-0.925; P$2 1.15,-0.925; P$3 1.15,0.925; P$4 -1.15,0.925

### Placement (x,y rotation side)
C1  14.48,26.04 0 top
C2  16,13.53 0 top
C3  19.68,22.61 0 top
C4  16,16.45 0 top
C5  8.76,16.51 180 top
C6  10.29,16.51 180 top
C7  9.4,22.42 270 top
C8  6.54,31.18 0 top
C9  8.57,31.18 0 top
C10  10.6,31.18 0 top
C11  13.65,28.38 90 top
C12  8.51,40.77 90 top
C13  20.52,10.86 270 top
C14  43.05,41.08 270 top
C15  43.05,35.88 90 top
C16  19.76,16.95 180 top
C17  26.61,33.72 270 top
C18  38.04,46.23 270 top
C19  43.05,34.35 90 top
C20  25.84,43.05 0 top
C21  16.51,43.81 180 top
C22  32.89,31.31 90 top
C23  28.51,27.43 0 top
D1  14.1,8.64 270 top
D2  21.02,7.56 90 top
D3  19.88,20.26 180 top
D4  2.03,30.48 180 top
D5  2.03,22.86 180 top
D6  2.03,25.4 180 top
D7  2.03,27.94 180 top
ESD1  8.32,36.39 0 top
F1  7.75,38.86 0 top
J1  0,9.91 270 top
J2  15.74,2.54 90 top
J3  36.06,2.54 90 top
J4  11.93,50.8 270 top
J5  33.52,50.8 270 top
J6  13.08,42.93 270 top
J7  43.68,27.94 0 top
J8  19.94,42.93 270 top
L1  17.59,10.41 90 top
L2  8.26,34.04 180 top
L3  8.57,26.29 180 top
L4  13.65,30.42 0 top
Q1  17.91,6.86 180 top
Q2  13.91,34.67 0 top
R1  12.57,16.45 0 top
R2  12.57,13.53 180 top
R3  11.62,36.89 90 top
R4  10.86,34.54 0 top
R5  7.05,21.65 180 top
R6  6.22,18.8 270 top
R7  5.46,16.51 180 top
R8  5.46,21.65 180 top
R9  13.91,32.19 270 top
R10  19.76,13.27 0 top
R11  21.29,13.27 180 top
R12  21.29,16.95 180 top
R13  40.77,38.48 180 top
R14  38.04,24.89 0 top
R15  33.46,24.89 0 top
R16  30.16,24.89 0 top
R17  38.86,27.56 270 top
R18  38.86,29.08 270 top
R19  21.53,25.46 180 top
R20  39.69,24.89 0 top
R21  19.88,25.46 0 top
R22  43.56,46.55 180 top
R23  41.91,46.55 180 top
R24  36.51,24.89 180 top
R25  16.19,22.8 0 top
R26  18.48,36.89 270 top
R27  16.51,46.86 0 top
R28  23.3,45.91 0 top
R29  34.99,24.89 0 top
R30  27.18,2.54 180 top
SW1  2.35,18.29 90 top
TP1  39.88,30.99 0 bottom
TP2  39.88,25.91 0 bottom
TP3  39.88,23.37 0 bottom
TP4  39.88,28.45 0 bottom
TP5  7.68,39.12 0 bottom
TP6  7.68,36.58 0 bottom
TP7  7.68,34.04 0 bottom
TP8  7.68,31.5 0 bottom
TP9  7.3,5.52 0 bottom
TP10  7.3,8.7 0 bottom
TP11  2.35,18.86 0 bottom
TP12  21.84,46.99 0 bottom
TP13  21.84,44.45 0 bottom
TP14  14.99,44.45 0 bottom
TP15  14.99,46.99 0 bottom
TP16  2.22,44.89 0 bottom
TP17  14.99,41.91 0 bottom
TP18  38.35,6.35 0 bottom
TP19  42.67,47.5 0 bottom
U1  5.33,44.89 90 top
U2  9.91,19.62 90 top
U3  35,13.84 270 top
U4  25.15,27.43 0 top
U5  33.21,38.86 90 top
U6  33.21,38.86 90 top
USB1  4.83,36.07 270 top
X1  43.05,38.48 270 top

### Tracks (layer width: path | path; a pad name or v marks a point on that pad's centre or on a via)
+3V3  (via drill 0.3 pad 0.64)
  Top 0.254: D4.+ 2.79,31.43 v3.11,31.75 | R14.1 R24.2 R29.1 R15.1 32.64,24.83 32.64,23.32 33.46,22.5 33.46,20.18 32.73,19.45 27.26,19.45 27.01,19.71 25.18,19.71 25.16,19.68
  Top 0.762: v25.78,8 v25.78,9.02 25.78,17.91 25.74,17.91 25.16,18.5 25.16,19.68 24.48,20.36 U3.8 23.49,21.34 22.23,22.61 C3.2
  Bottom 0.762: v4.25,41.97 3.49,41.21 3.49,38.8 3.11,38.42 3.11,33.72 3.43,33.4 3.43,32.07 v3.11,31.75 0.91,29.55 0.91,9.12 6.01,4.03 12.98,4.03 J2.4 14.5,2.54 15.96,1.08 25.23,1.08 26.09,1.94 26.09,3.15 25.15,4.09 25.15,7.37 v25.78,8 v25.78,9.02
  other vias: 4.25,43.31 3.49,42.61 2.73,41.97 1.97,42.61 1.21,41.97 5.02,42.61 5.78,41.97 6.54,42.61 5.78,43.31 5.02,43.94 5.02,45.28 4.25,44.58 4.25,45.91 5.02,46.55 4.25,47.18 5.02,47.82 5.78,47.18 5.78,45.91 5.78,44.58 6.54,43.94 6.54,45.28 6.54,46.55 6.54,47.82 3.49,47.82 2.73,47.18 1.97,47.82 1.21,47.18 5.78,48.45 4.25,48.45 2.73,48.45 1.21,48.45 5.02,41.34 3.49,41.34 1.97,41.34
  pour Top (rank 6, no thermals): 0,52.32 0,40.89 0.76,40.13 7.94,40.13 9.72,41.91 9.72,52.51 8.95,53.28 0.95,53.28
  pour Bottom (no thermals): 0.76,40.13 0,40.89 0,52.32 0.95,53.28 8.95,53.28 9.72,52.51 9.72,41.91 7.94,40.13
+5V  (via drill 0.3 pad 0.64)
  Top 0.254: U5.44 29.57,36.36 28.07,34.86 U6.44 | U5.34 29.57,41.36 28.07,42.86 U6.34 27.41,43.39 v26.99,43.81 | U5.24 35.21,42.83 36.41,44.03 U6.24 36.41,46.79 36.67,47.05 37.94,47.05 38.76,46.23 C18.1 | U5.14 37.44,37.36 38.34,36.46 U6.14 39.67,36.46 40.83,35.31 v40.96,35.31 | C11.2 L4.2 14.67,30.54 R9.1 | C12.2 10.43,41.93 12.94,41.93 | R11.2 R10.1 19.76,14.3 20.51,15.05 v20.51,15.12 | C1.2 16.19,25.97 R25.1 17.02,22.73 17.02,21.05 17.81,20.26 D3.- | U4.8 23.24,28.8 | C23.1 28.18,28.53 28.18,29.17
  Top 0.381: J2.5 17.01,2.56 15.76,3.81 10.66,3.81 J2.2 | C17.1 27.37,34.82 U6.44
  Top 0.762: U1.3 9.97,47.18 11.49,45.66 11.49,43.37 12.94,41.93 J6.3 | v27.81,43.81 v26.99,43.81 C20.1 21.83,43.81 J8.3 J6.3 | v40.96,35.31 v40.96,34.48 41.08,34.35 C19.1 42.29,33.59 43.05,32.83 44.14,32.83 44.91,32.06 44.91,30.52 J7.6 | C1.2 16.13,26.61 17.44,27.92 19.9,27.92 20.78,28.8 23.24,28.8 27.68,28.8 28.18,29.3 | 28.18,29.3 28.18,29.17 | C18.1 38.8,45.66 v38.16,45.02 v38.16,44.2 | Q2.2 14.8,34.6 15.05,34.85 15.05,39.96 J6.3 | C17.1 28.18,32.91 28.18,29.3
  Bottom 0.762: TP17.TP 13.1,41.91 J6.3 | v26.99,43.81 v27.81,43.81 28.96,44.96 38.1,44.96 v38.16,45.02 v38.16,44.2 39.38,42.98 39.38,36.89 v40.96,35.31 | J2.5 17.08,2.54 20.51,5.97 v20.51,15.12 20.51,19.75 v14.92,25.34 | v14.92,25.34 v14.92,26.73 v14.22,26.04 v14.92,25.34
  pour Top (no thermals): 13.78,24.89 13.78,34.1 13.91,34.23 15.18,34.23 15.3,34.1 15.3,27.18 15.43,27.05 16.76,27.05 16.76,25.02 16.64,24.89
_ACT  (via drill 0.3 pad 0.64)
  Top 0.254: v4.13,24.13 4.06,24.13 D6.+ | R26.2 16.19,38.35 v16.07,38.35
  Bottom 0.254: v4.13,24.13 4.13,25.41 4.89,26.16 4.89,26.79 4.38,27.3 4.38,31.22 4.7,31.54 4.7,32.81 5.46,33.58 5.46,38.69 7.13,40.36 8.24,40.36 10.24,38.35 v16.07,38.35
_D13  (via drill 0.3 pad 0.64)
  Top 0.254: v4.13,26.48 4.13,26.61 D7.+ | v17.72,46.04 17.65,46.1 R27.2
  Bottom 0.254: v17.72,46.04 17.21,46.04 16.8,45.63 16.8,41.36 14.34,38.89 10.49,38.89 8.51,40.87 6.92,40.87 4.95,38.9 4.95,33.78 4.19,33.02 4.19,31.75 3.87,31.43 3.87,26.73 v4.13,26.48
_ESP
  Top 0.254: D4.- 1.27,29.74 0.51,28.98 0.51,6.14 1.48,5.17 3.63,5.17 5.52,3.28 5.52,1.37 6.25,0.64 26.04,0.64 R30.1
_PWR  (via drill 0.3 pad 0.64)
  Top 0.254: D5.+ 4.13,21.53 v4.13,21.21 | R25.2 v16.19,20.89
  Bottom 0.254: v16.19,20.89 16.19,20.13 18.73,17.59 18.73,9.08 19.75,8.06 19.75,6.29 18.29,4.83 13.24,4.83 11.36,6.71 6.8,6.71 5.44,8.06 5.44,9.8 4.13,11.11 v4.13,21.21
ACT_LED  (via drill 0.3 pad 0.64)
  Top 0.254: U5.22 36.85,41.36 38.35,42.86 U6.22 37.34,42.86 v37.27,42.93 | v23.99,42.04 22.75,40.8 22.75,40.47 19.24,36.96 R26.1
  Bottom 0.254: v37.27,42.93 36.51,43.69 29.48,43.69 28.34,42.55 24.5,42.55 v23.99,42.04
AT_MISO  (via drill 0.3 pad 0.64)
  Top 0.254: U5.11 35.71,35.22 37.21,33.72 U6.11 38.93,33.06 41.51,30.48 J7.1 | v38.6,30.29 37.94,30.29 35.71,28.05 32.31,28.05 30.16,25.91 R16.1
  Bottom 0.254: J7.1 41.4,30.48 40.89,30.99 TP1.TP 39.18,30.29 v38.6,30.29
AT_MOSI
  Top 0.254: U5.10 35.21,34.89 36.41,33.69 U6.10 36.45,33.02 36.45,32.39 36.91,31.93 39.34,31.93 40.57,30.7 40.57,30.13 41.43,29.27 43.62,29.27 J7.5 43.73,26.73 41.91,26.73 41.09,27.56 R17.1
  Bottom 0.254: J7.5 43.74,29.15 40.58,29.15 TP4.TP
AT_SCK
  Top 0.254: U5.9 34.71,34.63 35.61,33.73 U6.9 35.59,33.04 35.59,32.45 36.62,31.42 39.13,31.42 39.62,30.93 R18.1 40.9,29.08 41.22,28.77 41.58,28.77 J7.2
  Bottom 0.254: J7.2 42.35,27.94 41.27,26.86 40.83,26.86 TP2.TP
AT_SS  (via drill 0.3 pad 0.64)
  Top 0.254: U5.8 34.21,34.31 34.81,33.71 U6.8 34.81,32.42 35.24,31.99 35.24,28.97 34.83,28.56 32.1,28.56 30.02,26.48 29.59,26.48 29.34,26.23 29.34,24.13 27.97,22.76 23.55,22.76 21.61,24.7 R19.1 20.83,24 20.54,24 20.07,23.53 v20.07,21.65 | v22.42,5.33 21.84,5.91 D2.+
  Bottom 0.254: v20.07,21.65 20.51,21.21 20.51,20.82 21.27,20.06 21.27,6.48 v22.42,5.33
BOOT_MODE  (via drill 0.3 pad 0.64)
  Top 0.254: R24.1 36.51,23.45 37.46,22.5 37.46,20.18 35.82,18.54 v34.92,18.54 34.92,9.86 32.79,7.72 31.53,7.72 30.48,6.67 U3.18 | R28.2 24.13,45.15 v24.45,44.83
  Bottom 0.254: v34.92,18.54 34.92,21.18 33.49,22.62 33.49,23.23 35.31,25.05 35.31,32.04 36.61,33.35 36.61,34.78 37.6,35.77 37.6,41.39 37.31,41.68 36.7,41.68 35.7,42.67 30.64,42.67 29.84,41.87 29.23,41.87 29.06,42.04 25.03,42.04 24.3,41.3 23.69,41.3 23.26,41.73 23.26,42.34 23.69,42.78 23.92,42.78 24.45,43.31 v24.45,44.83
D+  (via drill 0.3 pad 0.64)
  Top 0.254: U5.4 32.21,34.31 31.61,33.71 U6.4 31.61,32.19 31.31,31.89 31.16,31.75 31.03,31.61 31.03,31.28 v30.23,30.48 | R4.2 11.87,34.8 v11.94,34.8
  Bottom 0.254: v11.94,34.8 12.2,35.05 12.25,35.05 12.76,35.56 17.12,35.56 17.81,36.26 24.16,36.26 25.36,35.05 26.63,35.05 27.94,33.74 27.94,31.1 28.68,30.36 30.1,30.36 v30.23,30.48
D-  (via drill 0.3 pad 0.64)
  Top 0.254: U5.3 31.71,34.63 30.8,33.72 30.8,33.08 U6.3 30.81,32.11 v30.29,31.62 | R3.2 11.94,36.45 v11.94,35.81
  Bottom 0.254: v30.29,31.62 v30.28,31.62 29.52,30.86 28.9,30.86 28.45,31.31 28.45,33.95 26.84,35.56 25.57,35.56 24.37,36.77 17.6,36.77 16.91,36.07 12.2,36.07 v11.94,35.81
ESP_EN  (via drill 0.3 pad 0.64)
  Top 0.254: U5.33 30.71,42.51 30.19,43.02 | 29.91,43.31 29.21,44.01 U6.33 | 29.91,43.31 30.19,43.02 | U3.3 34.48,22.67 v34.23,22.92 33.47,23.69 R15.2 | 29.91,43.31 29.91,42.98 v29.53,42.6 29.95,43.02 30.19,43.02
  Bottom 0.254: v34.23,22.92 35.81,24.51 35.81,31.83 37.12,33.14 37.12,34.57 38.11,35.55 38.11,41.65 37.57,42.19 36.91,42.19 35.92,43.18 30.11,43.18 v29.53,42.6
GND  (via drill 0.3, 0.3 pad 0.64)
  Top 0.254: C19.2 C15.1 | C15.1 42.29,36.51 42.13,36.67 X1.P$2 | U5.43 29.24,36.86 28.04,35.66 U6.43 | U5.35 29.24,40.86 28.04,42.06 U6.35 26.58,42.06 26.35,42.29 C20.2 | U5.23 35.71,42.51 37.21,44.01 U6.23 37.27,44.73 C18.2 | U5.15 37.77,37.86 38.37,37.26 U6.15 39.67,37.26 40.29,36.64 41.19,36.64 41.58,36.26 41.91,36.26 C15.1 | C10.1 C9.1 C8.1 | C11.1 12.76,26.1 C1.1 | v9.97,19.68 v9.97,20.57 9.97,20.89 | v9.53,21.34 9.97,20.89 | 9.97,20.89 v10.41,21.34 v11.3,21.34 11.3,20.69 U2.4 | D7.- D6.- D5.- | C12.1 8.51,41.53 U1.1 | D1.+ 15.88,10.79 16.26,10.41 18.37,10.41 18.67,10.12 18.67,8 Q1.1 | J2.6 17.71,4.38 5.13,4.38 3.84,5.67 1.75,5.67 1.02,6.41 1.02,14.45 SW1.1 | C14.1 43.81,40.64 43.98,40.48 X1.P$4
  Top 0.508: J1.CDN1 13.01,10.79 D1.+ 14.35,11.04 C2.1 C4.1 | C5.1 R7.1 | v10.41,52.58 7.36,52.58 J4.7
  Bottom 0.889: TP10.TP J1.CDN4
  other vias: 11.94,32.58 11.94,31.69 5.14,30.86 5.14,29.84 5.14,28.83 5.14,27.81 11.49,28.83 11.49,27.94 11.49,27.05 11.49,26.16 11.49,25.27 31.24,36.96 32.51,36.96 33.78,36.96 35.05,36.96 34.42,37.72 33.15,37.72 31.88,37.72 31.24,38.48 32.51,38.48 33.78,38.48 35.05,38.48 34.42,39.24 33.15,39.24 31.88,39.24 31.24,40.01 32.51,40.01 33.78,40.01 35.05,40.01 34.42,40.77 33.15,40.77 31.88,40.77 10.41,44.77 10.41,42.74 10.41,43.75 11.68,39.88 11.68,40.89 22.92,20.32 17.72,45.02 17.72,44.07 34.48,49.02 35.62,49.02 36.77,49.02 35.05,48.2 39.37,48.13 40.2,46.42 16.95,34.29 18.35,34.8 19.3,34.8 16,34.29 20.26,34.8 17.4,38.61 17.4,39.62 17.4,40.64 23.3,6.67 27.94,9.33 27.3,8.57 28.57,8.57 29.84,8.57 29.21,9.33 30.48,9.33 31.75,9.33 31.11,10.1 29.84,10.1 28.57,10.1 27.3,10.1 27.94,10.86 29.21,10.86 30.48,10.86 31.75,10.86 31.11,11.62 29.84,11.62 28.57,11.62 27.3,11.62 27.94,12.38 29.21,12.32 30.48,12.32 31.75,12.32 31.11,13.08 29.84,13.08 28.57,13.14 27.3,13.14 27.94,13.91 29.21,13.91 30.48,13.91 29.84,14.67 28.57,14.67 27.3,14.67 27.94,15.43 29.21,15.43 28.57,16.19 27.3,16.19 27.94,16.95 27.3,17.72 21.53,42.1 21.53,41.21 21.53,40.32 18.54,25.78 17.59,25.4 19.49,18.8 19.49,15.11 29.27,4.7 30.23,4.7 31.18,4.7 38.73,15.37 38.73,14.41 38.73,13.46 38.73,12.51 38.73,11.56 38.73,10.6 38.73,9.65 38.73,8.7 17.59,26.35 21.97,27.43 29.78,28.77 30.73,28.77 29.78,27.81 33.4,19.05 41.78,23.5 42.74,23.5 43.69,23.5 44.64,23.5 45.59,23.5 23.3,7.56 33.53,1.46 36.07,1.46 38.61,1.46 10.67,1.46 8.32,1.46 27.94,0.83 28.45,24.51 28.45,25.46 20.19,47.82 18.16,47.82 11.24,49.09 12.7,49.09 11.94,48.51 2.48,11.37 3.17,12.13 3.17,13.65 2.48,12.89 3.17,10.6 2.48,9.84 11.37,52.58 24.7,47.82 25.65,47.82 36.07,52.45 21.84,30.92 21.84,29.97 19.49,9.53 11.81,24 13.08,24 14.41,24 12.45,23.3 13.72,23.3 14.41,22.61 13.08,22.61 13.72,21.91 15.05,23.3 15.05,21.91 14.41,21.21 13.72,20.57 15.05,20.51 23.88,40.45 22.48,39.05 18.61,18.8 21.02,27.43 34.48,29.53 33.53,29.53 32.58,29.53 18.54,26.73 17.59,24.45 27.18,26.29 27.18,27.43 19.3,23.3 23.18,39.75 22.48,42.55 22.48,41.66 16.38,39.62 10.86,40.39 44.77,35.12 44.77,40.77 44.77,38.54 40.2,44.13 40.2,45.28 39.37,44.7 40.2,47.56 40.96,48.13 40.2,48.7 36.2,48.2 45.85,52.39 45.21,51.63 46.48,51.63 45.85,50.86 45.21,50.1 46.48,50.1 45.85,49.34 46.48,48.58 45.85,47.82 46.48,47.05 45.85,46.29 46.48,45.53 45.85,44.83 46.48,44.07 15.75,48.58 2.48,29.21 2.48,26.67 2.48,24.13
  pour Bottom (no thermals): 5.33,5.21 4.76,5.78 4.76,23.05 6.03,24.32 10.29,24.32 12.76,21.84 12.76,20 13.27,19.47 16.26,19.47 18.29,17.46 18.29,9.02 19.43,7.87 19.43,5.4 19.24,5.21
  pour Top (rank 4, no thermals): 5.33,5.21 4.76,5.78 4.76,23.05 4.83,23.11 12.51,23.11 12.76,22.86 12.76,20.38 13.65,19.47 16.26,19.47 18.29,17.46 18.29,9.65 19.43,8.51 19.43,5.4 19.24,5.21
  pour Top (rank 4, no thermals): 0.19,39.24 0.19,32.89 0.83,32.26 4.64,32.26 5.78,31.11 12.06,31.11 12.38,31.43 12.38,37.59 10.16,39.81 0.76,39.81
  pour Bottom (no thermals): 0.19,39.24 0.19,32.89 0.83,32.26 3.56,32.26 4.76,31.05 4.76,22.99 4.83,22.92 4.89,22.92 6.03,24.07 6.03,28.19 6.1,28.26 10.79,28.26 12.38,29.84 12.38,37.59 10.16,39.81 0.76,39.81
  pour Bottom (no thermals): 10.79,28.77 10.79,28.26 11.11,28.26 11.11,25.21 11.43,24.89 13.34,24.89 13.46,25.02 13.46,27.37 11.56,29.27 11.3,29.27
  pour Top (no thermals): 11.3,24.89 11.11,25.08 11.11,28.96 11.37,29.21 13.21,29.21 13.46,28.96 13.46,25.02 13.34,24.89
  pour Top (rank 5, no thermals): 0,31.11 0,1.02 1.02,0 39.56,0 39.56,22.16 40.26,22.86 46.86,22.86 47.5,23.5 47.5,52.26 46.48,53.28 10.48,53.28 10.03,52.83 10.03,43.56 9.72,43.24 7.43,43.24 7.37,43.18 7.37,40.39 7.87,39.88 9.78,39.88 9.91,39.75 9.91,37.85 10.1,37.66 14.61,37.66 15.49,36.77 15.49,33.21 11.11,28.83 11.11,23.94 13.14,21.91 13.14,20.13 13.53,19.75 16.32,19.75 18.54,17.53 18.54,10.73 19.05,10.22 19.05,9.33 19.75,8.64 19.75,5.4 19.18,4.83 5.59,4.83 4.32,6.1 4.32,31.05 3.43,31.94 0.83,31.94
  pour Bottom (rank 5, no thermals): 0,31.11 0,1.02 1.02,0 39.56,0 39.56,22.16 40.26,22.86 46.86,22.86 47.5,23.5 47.5,52.26 46.48,53.28 10.48,53.28 10.03,52.83 10.03,41.91 7.94,39.81 6.1,39.81 5.71,39.43 5.71,33.34 7.56,31.5 9.72,31.5 12.37,34.15 12.64,33.89 12.64,29.65 11.11,28.13 11.11,23.94 13.14,21.91 13.14,20.13 13.53,19.75 16.32,19.75 18.54,17.53 18.54,10.73 19.05,10.22 19.05,9.33 19.75,8.64 19.75,5.4 19.18,4.83 5.59,4.83 4.32,6.1 4.32,31.05 3.43,31.94 0.83,31.94
  pour Top (no thermals): 3.62,32.51 3.62,32.19 4.76,31.05 4.76,27.62 4.95,27.43 5.33,27.43 5.52,27.62 5.52,30.86 5.84,31.18 5.84,31.56 4.76,32.64 3.75,32.64
GPIO2_LED
  Top 0.254: R30.2 28.48,4.61 U3.17 28.48,6.67 29.53,7.72 30.81,7.72 31.32,8.23 32.58,8.23 34.42,10.07 34.42,18.01 34.19,18.24 34.19,18.85 35.46,20.12 35.46,22.85 34.99,23.32 R29.2
GPIO12
  Top 0.254: R16.2 28.48,22.45 U3.6
GPIO13
  Top 0.254: R17.2 37.53,26.99 32.72,26.99 31.5,25.77 31.5,20.22 31.24,19.96 27.47,19.96 26.48,20.95 U3.7
GPIO14
  Top 0.254: R18.2 36.51,27.5 32.51,27.5 30.99,25.98 30.99,22.71 30.48,22.2 U3.5
GPIO15  (via drill 0.3 pad 0.64)
  Top 0.254: v26.15,18.91 26.55,18.51 26.55,6.41 U3.16 | v18.86,24.51 19.24,24.51 19.43,24.7 R21.2 21.4,26.23 R19.2
  Bottom 0.254: v26.15,18.91 26.15,19.41 21.05,24.51 v18.86,24.51
GPIO16
  Top 0.254: R20.2 38.86,24.96 38.86,26.19 38.57,26.48 32.93,26.48 32.07,25.62 32.07,23.17 32.48,22.76 U3.4
N$3
  Top 0.254: R9.2 13.14,33.53 Q2.1
N$7  (via drill 0.3 pad 0.64)
  Top 0.203: U2.6 7.3,19.95 7.23,19.88 v6.29,19.88
  Top 0.254: R2.2 R1.2 12.54,15.72 v11.46,15.72
  Bottom 0.203: v11.46,15.72 7.33,15.72 6.29,16.76 v6.29,19.88
N$8
  pour Top (no thermals): 16.51,9.59 16.51,8.38 16.89,8 17.21,8 18.29,9.08 18.29,9.91 18.16,10.03 16.95,10.03
N$13
  Top 0.254: R12.2 C16.1
N$15
  Top 0.203: C7.2 R5.2
N$23
  Top 0.254: R7.2 R6.2 R8.1
PIN_A0  (via drill 0.3 pad 0.64)
  Top 0.254: U5.36 28.98,40.36 28.07,41.27 27.42,41.27 U6.36 25.83,41.26 21.09,36.52 21.09,34.21 22.29,33.01 v22.29,32.64
  Bottom 0.254: J3.1 30.54,2.54 32.69,4.7 32.69,13.62 22.8,23.52 22.8,31.12 22.29,31.63 v22.29,32.64
PIN_A1  (via drill 0.3 pad 0.64)
  Top 0.254: U5.37 28.65,39.86 28.05,40.46 U6.37 25.75,40.46 21.59,36.31 21.59,34.42 23.05,32.96 v23.05,31.94
  Bottom 0.254: J3.2 33.2,3.49 33.2,13.84 23.3,23.73 23.3,31.69 v23.05,31.94
PIN_A2  (via drill 0.3 pad 0.64)
  Top 0.254: U5.38 28.39,39.36 28.09,39.66 U6.38 25.67,39.66 22.35,36.35 v22.35,34.8
  Bottom 0.254: J3.3 33.71,3.62 33.71,14.04 23.81,23.94 23.81,32.28 22.35,33.74 v22.35,34.8
PIN_A3  (via drill 0.3 pad 0.64)
  Top 0.254: U5.39 U6.39 25.59,38.86 23.11,36.39 v23.11,34.1
  Bottom 0.254: J3.4 36.51,2.54 34.22,4.83 34.22,14.26 24.32,24.15 24.32,32.51 23.11,33.71 v23.11,34.1
PIN_A4  (via drill 0.3 pad 0.64)
  Top 0.254: U5.40 28.39,38.36 28.09,38.06 U6.40 27.38,38.1 25.57,38.1 23.88,36.4 v23.88,34.73
  Bottom 0.254: v23.88,34.73 23.88,33.67 24.83,32.72 24.83,24.36 34.73,14.47 34.73,5.04 36.02,3.75 37.83,3.75 39.04,2.54 J3.5
PIN_A5  (via drill 0.3 pad 0.64)
  Top 0.254: U5.41 28.65,37.86 28.05,37.26 U6.41 26.74,37.26 26.41,37.59 25.78,37.59 24.64,36.44 v24.64,33.97
  Bottom 0.254: J3.6 41.58,2.54 40.37,3.75 38.55,3.75 38.04,4.25 36.23,4.25 35.23,5.25 35.23,14.68 25.34,24.57 25.34,33.24 24.64,33.94 v24.64,33.97
PIN_AREF  (via drill 0.3 pad 0.64)
  Top 0.254: U5.42 28.98,37.36 28.08,36.46 U6.42 26.47,36.46 v26.1,36.83 | v17.72,43.05 C21.1 14.12,45.45 14.12,46.74 13.74,47.12 11.11,47.12 8.72,49.51 4.33,49.51 J4.8
  Bottom 0.254: v17.72,43.05 18.22,42.55 18.22,38.59 19.03,37.78 25.15,37.78 v26.1,36.83
PIN_D0
  Top 0.254: U5.20 37.44,40.36 38.35,41.27 38.37,41.26 U6.20 39.64,41.26 42.74,44.36 42.74,46.45 43.56,47.27 R22.2 43.56,47.95 43.11,48.4 43.11,49.03 42.41,49.73 J5.1
  Bottom 0.254: J5.1 41.2,52.01 39.37,52.01 38.66,51.3 38.66,49.48 35.42,46.23 26.87,46.23 26.43,46.67 23.25,46.67 22.92,46.99 TP12.TP 20.78,45.93 J8.1
PIN_D1
  Top 0.254: U5.21 37.18,40.86 38.38,42.06 U6.21 39.64,42.06 41.08,43.51 41.08,46.45 41.91,47.27 R23.2 41.91,48.76 J5.2
  Bottom 0.254: J5.2 39.87,49.96 35.63,45.73 26.66,45.73 26.22,46.16 23.55,46.16 TP13.TP 21.59,44.45 21.07,43.93 J8.2
PIN_D2_SDA  (via drill 0.3 pad 0.64)
  Top 0.254: U5.19 37.77,39.86 38.37,40.46 U6.19 39.05,40.5 39.74,40.5 40.14,40.9 40.14,41.02 43.19,44.07 v44.39,44.07 44.39,47.84 43.62,48.62 43.62,51.78 43.33,52.07 39.43,52.07 38.16,50.8 J5.3 | U4.5 27.03,30.15 27.03,32.14 26.63,32.54 v26.63,32.57 | U3.19 32.48,6.7 35.44,9.65 35.44,15.94 v35.69,16.19
  Bottom 0.254: J5.3 36.55,50.8 34.77,52.58 15.81,52.58 14.53,51.3 14.53,49.23 12.05,46.74 12.05,45.11 13.08,44.08 J6.2 14.16,43.93 14.68,44.45 TP14.TP | v26.63,32.57 26.9,32.31 26.9,31.32 26.36,30.78 26.36,24.99 35.16,16.19 v35.69,16.19 v35.69,16.2 36.7,16.2 37.84,17.34 37.84,17.97 37.34,18.47 37.34,31.14 38.88,32.68 45.36,32.68 46.55,33.88 46.55,41.57 44.39,43.74 v44.39,44.07
PIN_D3_SCL  (via drill 0.3 pad 0.64)
  Top 0.254: U5.18 38.03,39.36 38.33,39.66 U6.18 39.7,39.66 40.65,40.62 40.65,40.81 43.18,43.33 44.69,43.33 45.12,43.76 45.12,44.37 44.9,44.6 44.9,48.05 44.39,48.56 v44.39,48.9 44.12,49.16 44.12,51.99 43.54,52.58 37.4,52.58 35.62,50.8 J5.4 | v26.16,31.62 25.78,31.25 U4.6 | v36.26,15.37 35.94,15.05 35.94,9.44 34.48,7.98 U3.20
  Bottom 0.254: J5.4 33.51,52.07 17.84,52.07 17.07,51.3 17.07,50.23 16.25,49.4 15.43,49.4 14.99,48.96 TP15.TP 14.97,46.99 13.91,45.93 J6.1 | v26.16,31.62 25.85,31.31 25.85,24.78 35.26,15.37 v36.26,15.37 36.59,15.37 38.35,17.13 38.35,18.18 37.85,18.68 37.85,30.93 39.09,32.17 45.57,32.17 47.06,33.66 47.06,41.78 45.12,43.72 45.12,44.37 44.39,45.11 v44.39,48.9
PIN_D4
  Top 0.203: U6.25 35.61,46.42 32.25,49.78 J5.5
  Top 0.254: U5.25 34.71,43.09 35.61,43.99 U6.25
PIN_D5  (via drill 0.3 pad 0.64)
  Top 0.254: U5.31 31.71,43.09 30.8,44.01 30.8,44.65 U6.31 30.81,46.83 30.08,47.56 27.54,47.56 27.28,47.82 v26.92,47.82
  Bottom 0.254: v26.92,47.82 26.92,48.01 J5.6
PIN_D6
  Top 0.254: U5.27 33.71,43.68 34.01,43.98 U6.27 34.01,46.51 30.92,49.59 28.38,49.59 J5.7
PIN_D7  (via drill 0.3)
  Top 0.254: v29.26,34.95 29.21,34.9 U6.1 29.21,33.72 30.71,35.22 U5.1
  Bottom 0.254: v29.26,34.95 v29.26,34.96 25.93,38.29 19.24,38.29 18.86,38.67 18.86,47.57 20.25,48.96 22.79,48.96 J5.8
PIN_D8
  Top 0.254: U5.28 U6.28 33.04,44.83 33.04,46.76 30.71,49.09 28.17,49.09 27.66,49.59 22.03,49.59 J4.1
PIN_D9
  Top 0.254: U5.29 32.71,43.68 32.41,43.98 U6.29 32.41,46.67 30.5,48.58 27.96,48.58 27.45,49.09 21.82,49.09 21.31,49.59 19.49,49.59 J4.2
PIN_D10
  Top 0.254: U5.30 32.21,43.42 31.61,44.02 U6.30 31.61,46.75 30.29,48.07 27.75,48.07 27.24,48.58 21.61,48.58 21.1,49.09 19.28,49.09 18.77,49.59 16.95,49.59 J4.3
PIN_D11  (via drill 0.3 pad 0.64)
  Top 0.254: U5.12 36.85,36.36 38.35,34.86 U6.12 38.46,34.86 v37.86,34.27 | J4.4 14.41,49.59 16.23,49.59 16.74,49.09 18.56,49.09 19.07,48.58 20.89,48.58 21.39,48.07 23.37,48.07 25.91,45.53 v25.91,45.4
  Bottom 0.254: v37.86,34.27 38.62,35.02 38.62,42.67 37.09,44.2 29.27,44.2 28.13,43.05 26.67,43.05 25.91,43.82 v25.91,45.4
PIN_D12
  Top 0.254: U5.26 34.21,43.42 34.81,44.02 U6.26 34.81,46.53 31.04,50.3 31.04,51.17 30.21,52.01 12.64,52.01 11.43,50.8 J4.5
PIN_D13
  Top 0.254: U5.32 31.21,42.83 30.01,44.03 U6.32 30.01,45.3 29.4,45.91 29.02,45.91 27.75,44.64 25.53,44.64 25.21,44.96 25.21,45.15 23.69,46.67 R28.1 22.61,46.67 22.32,46.96 17.88,46.96 17.22,47.62 R27.1 11.36,47.62 8.18,50.8 J4.6
RESET  (via drill 0.3 pad 0.64)
  Top 0.254: U5.13 37.18,36.86 38.38,35.66 U6.13 39.03,35.68 39.62,35.68 40.14,35.16 40.14,34.15 42.48,31.81 43.46,31.81 43.74,31.53 43.74,29.86 44.46,29.15 45.45,29.15 46.16,28.44 46.16,27.44 45.45,26.73 44.45,26.73 43.95,26.23 43.24,26.23 J7.3 42.16,25.65 R20.1 | J2.3 13.27,1.21 25.45,1.21 26.23,1.99 v26.23,4.64 23.94,4.64 23.3,5.27 23.3,5.52 22.1,6.72 22.1,10.06 21.88,10.29 21.86,10.29 C13.1 R11.1 22.11,13.36 22.11,15.37 R12.1 22.11,17.02 22.11,18.25 21.53,18.84 D3.+
  Bottom 0.254: v26.23,4.64 27.04,3.82 27.04,2.83 29.23,0.64 42.21,0.64 43.62,2.04 43.62,3.04 42.91,3.75 41.09,3.75 40.58,4.25 38.76,4.25 38.25,4.76 36.44,4.76 35.75,5.45 35.75,13.66 38.86,16.77 38.86,18.39 38.35,18.89 38.35,23.37 TP3.TP 40.83,24.32 41.33,24.32 J7.3
RST
  Top 0.254: R14.2 38.04,23.18 38.48,22.73 U3.1
RSTAT
  Top 0.254: R10.2 C13.2 19.75,10.48 D2.- 19.94,8.13 19.94,7.21 19.59,6.86 16.38,6.86 15.88,7.36 15.88,7.96 15.53,8.31 12.73,8.31 11.09,6.67 8.93,6.67 7.15,4.89 5.34,4.89 4.05,6.18 2.01,6.18 1.52,6.67 1.52,13.5 3.38,15.36 3.38,16.22 1.78,17.82 1.78,20.22 SW1.2
  Bottom 0.254: SW1.2 TP11.TP
RXD  (via drill 0.3 pad 0.64)
  Top 0.254: R23.1 v41.91,44.83 | v36.32,17.02 36.32,16.6 37,15.93 37,15.06 36.48,14.54 U3.21
  Bottom 0.254: v36.32,17.02 36.32,31.62 38.4,33.7 44.94,33.7 45.54,34.3 45.54,41.15 41.91,44.78 v41.91,44.83
SW_BS
  Top 0.254: U2.5 7.85,20.6 7.56,20.89 R5.1
SW_F1
  Top 0.254: R8.2 5.46,26.91 7.01,28.46 L3.2
  pour Top (no thermals): 7.81,27.62 5.84,29.59 5.84,30.73 5.91,30.8 12,30.8 12.32,31.11 13.08,31.11 13.14,31.05 13.14,29.78 13.08,29.72 11.43,29.72 10.67,28.96 10.67,27.62
SW_FB
  Top 0.254: U2.8 7.13,18.65 R6.1
SW_SS
  Top 0.203: C6.2 10.29,17.4 11.21,18.32 U2.1
SW_VCAP
  Top 0.254: U2.7 8.68,19.23 9.36,19.23 9.59,19 9.59,18.29 8.76,17.46 C5.2
SW_VCC_IN
  pour Top (no thermals): 11.68,19.43 11.68,19.18 12.13,18.73 12.13,16.83 12.19,16.76 12.95,16.76 13.02,16.83 13.02,17.78 13.14,17.91 16.45,17.91 17.02,17.34 17.02,12.19 16.89,12.06 16.89,10.92 17.02,10.79 18.16,10.79 18.29,10.92 18.29,17.46 16.26,19.47 11.75,19.47
SW_VCC_OUT
  pour Top (isolate 0.254, no thermals): 6.48,24.96 6.48,23.24 9.14,23.24 9.72,22.67 9.72,22.03 9.78,21.97 11.56,21.97 12.09,21.46 12.09,20.45 11.68,20.07 11.68,19.88 11.75,19.77 12.46,19.77 12.76,20.14 12.76,21.84 9.65,24.96
TXD  (via drill 0.3 pad 0.64)
  Top 0.254: v37.08,17.65 37.08,16.56 37.51,16.14 37.51,14.85 37.02,14.37 37.02,8.19 38.48,6.74 U3.22 | v43.56,44.83 R22.1
  Bottom 0.254: v37.08,17.65 36.83,17.91 36.83,31.35 38.67,33.19 45.15,33.19 46.05,34.09 46.05,41.36 43.56,43.85 v43.56,44.83
UCAP
  Top 0.254: U5.6 U6.6 33.21,32.26 33.66,31.81 C22.2
UD+  (via drill 0.3 pad 0.64)
  Top 0.203: v6.22,35.37 6.22,35.39 6.97,36.14 8.61,36.14 ESD1.2
  Top 0.254: USB1.3 5.52,36.07 v6.22,35.37 | ESD1.2 9.85,35.49 10.03,35.31 R4.1
  Bottom 0.254: v6.22,35.37 6.29,35.37 7.62,34.04 TP7.TP
UD-  (via drill 0.3 pad 0.64)
  Top 0.203: v6.22,36.39 6.64,36.39 6.88,36.63 8.61,36.63 ESD1.3
  Top 0.254: USB1.2 5.83,36.72 6.16,36.39 v6.22,36.39 | ESD1.3 9.77,37.28 10.16,36.89 R3.1
  Bottom 0.254: v6.22,36.39 6.6,36.39 6.79,36.58 TP6.TP
UGND  (via drill 0.3 pad 0.64)
  Top 0.203: v6.22,34.35 6.54,34.04 L2.2 7.57,34.24 ESD1.1
  Top 0.254: U5.5 32.71,34.04 32.41,33.74 U6.5 32.41,32.16 32.13,31.88 C22.1 v31.3,30.48 | USB1.5 5.75,34.77 6.17,34.35 v6.22,34.35
  Bottom 0.254: v31.3,30.48 30.54,29.72 29.91,29.72 29.79,29.85 28.48,29.85 27.43,30.89 27.43,33.53 26.42,34.55 25.15,34.55 23.95,35.75 18.02,35.75 17.33,35.05 13.27,35.05 9.71,31.5 TP8.TP
  Bottom 0.762: TP8.TP 6.22,32.96 v6.22,34.35
UVCC  (via drill 0.3 pad 0.64)
  Bottom 0.762: v6.22,37.4 6.25,37.43 6.25,37.68 TP5.TP
  pour Top (no thermals): 5.14,37.47 5.14,37.27 5.21,37.21 5.91,37.21 6.1,37.05 7.3,37.05 7.56,37.27 7.56,37.53 6.99,38.1 5.78,38.1
VIN
  Top 1.016: J2.8 22.98,4.19 20,4.19 18.35,5.84 Q1.3
  Bottom 0.889: TP9.TP J1.VCC4
  pour Top (no thermals): 8.64,5.91 8.64,5.14 9.02,4.76 11.3,4.76 11.75,5.21 18.35,5.21 18.41,5.27 18.41,6.29 18.35,6.35 16.19,6.35 14.86,7.68 12.95,7.68 11.62,6.35 9.08,6.35
VUSB  (via drill 0.3 pad 0.64)
  Top 0.254: U5.2 31.21,34.89 30.01,33.69 U6.2 30.01,32.42 v29.21,31.62 29.23,31.6 29.23,30.43 29.92,29.74 31.61,29.74 32.35,30.48 34.19,30.48 34.48,30.77 34.48,31.84 34.01,32.31 U6.7 34.01,33.74 33.71,34.04 U5.7
  Top 0.635: F1.2 10.73,38.86 11.37,38.23 13.08,38.23 13.91,37.4 v13.91,36.83 Q2.3
  Bottom 0.254: v29.21,31.62 29.21,33.96 27.1,36.07 25.78,36.07 24.58,37.27 17.39,37.27 16.82,36.71 14.03,36.71 v13.91,36.83
XTAL1
  Top 0.254: U5.17 U6.17 39.88,38.86 40.26,39.24 R13.2 41.34,39.24 41.73,39.63 X1.P$1 42.13,40.35 42.29,40.51 C14.2
XTAL2
  Top 0.254: C15.2 43.81,36.39 43.98,36.55 X1.P$3 42.82,38.49 41.57,38.49 40.8,37.72 R13.1 40.26,37.72 39.92,38.06 U6.16 38.33,38.06 38.03,38.36 U5.16

### Text on the board
tNames: ESD1
silktop: A | R | E | F | G | N | D | ~ | 1 | 3 | 1 | 2 | ~ | 1 | 1 | ~ | 1 | 0 | ~ | 9 | 8 | 7 | ~ | 6 | ~ | 5 | 4 | ~ | 3 | 2 | T | x | 1 | R | x | 0 | A | T | m | e | g | a | 3 | 2 | U | 4 | I2C | UART | ICSP | E | S | 1 | P | D | ECC / 608 | 1 | 3 | A | C | T | P | W | R | RESET | 5V | RST | 33 | V | 5 | V | GND | V | i | n | A0 | A1 | A2 | A3 | A4 | A5
silkbottom: SCL | RX | SDA | TX | VCC | VCC | GND | GND | Grove / I2C | Grove / UART | Adelino X3 / http://adelino.cc / Pre-Production / Designed in Brazil | MISO | VCC | SCK | MOSI | RST | GND | Visit adelino.cc | DC IN | 7-15V